# EAGLE design Iridium_9603_Beacon (EAGLE 8.6.0)

## Sheet 1 of 7
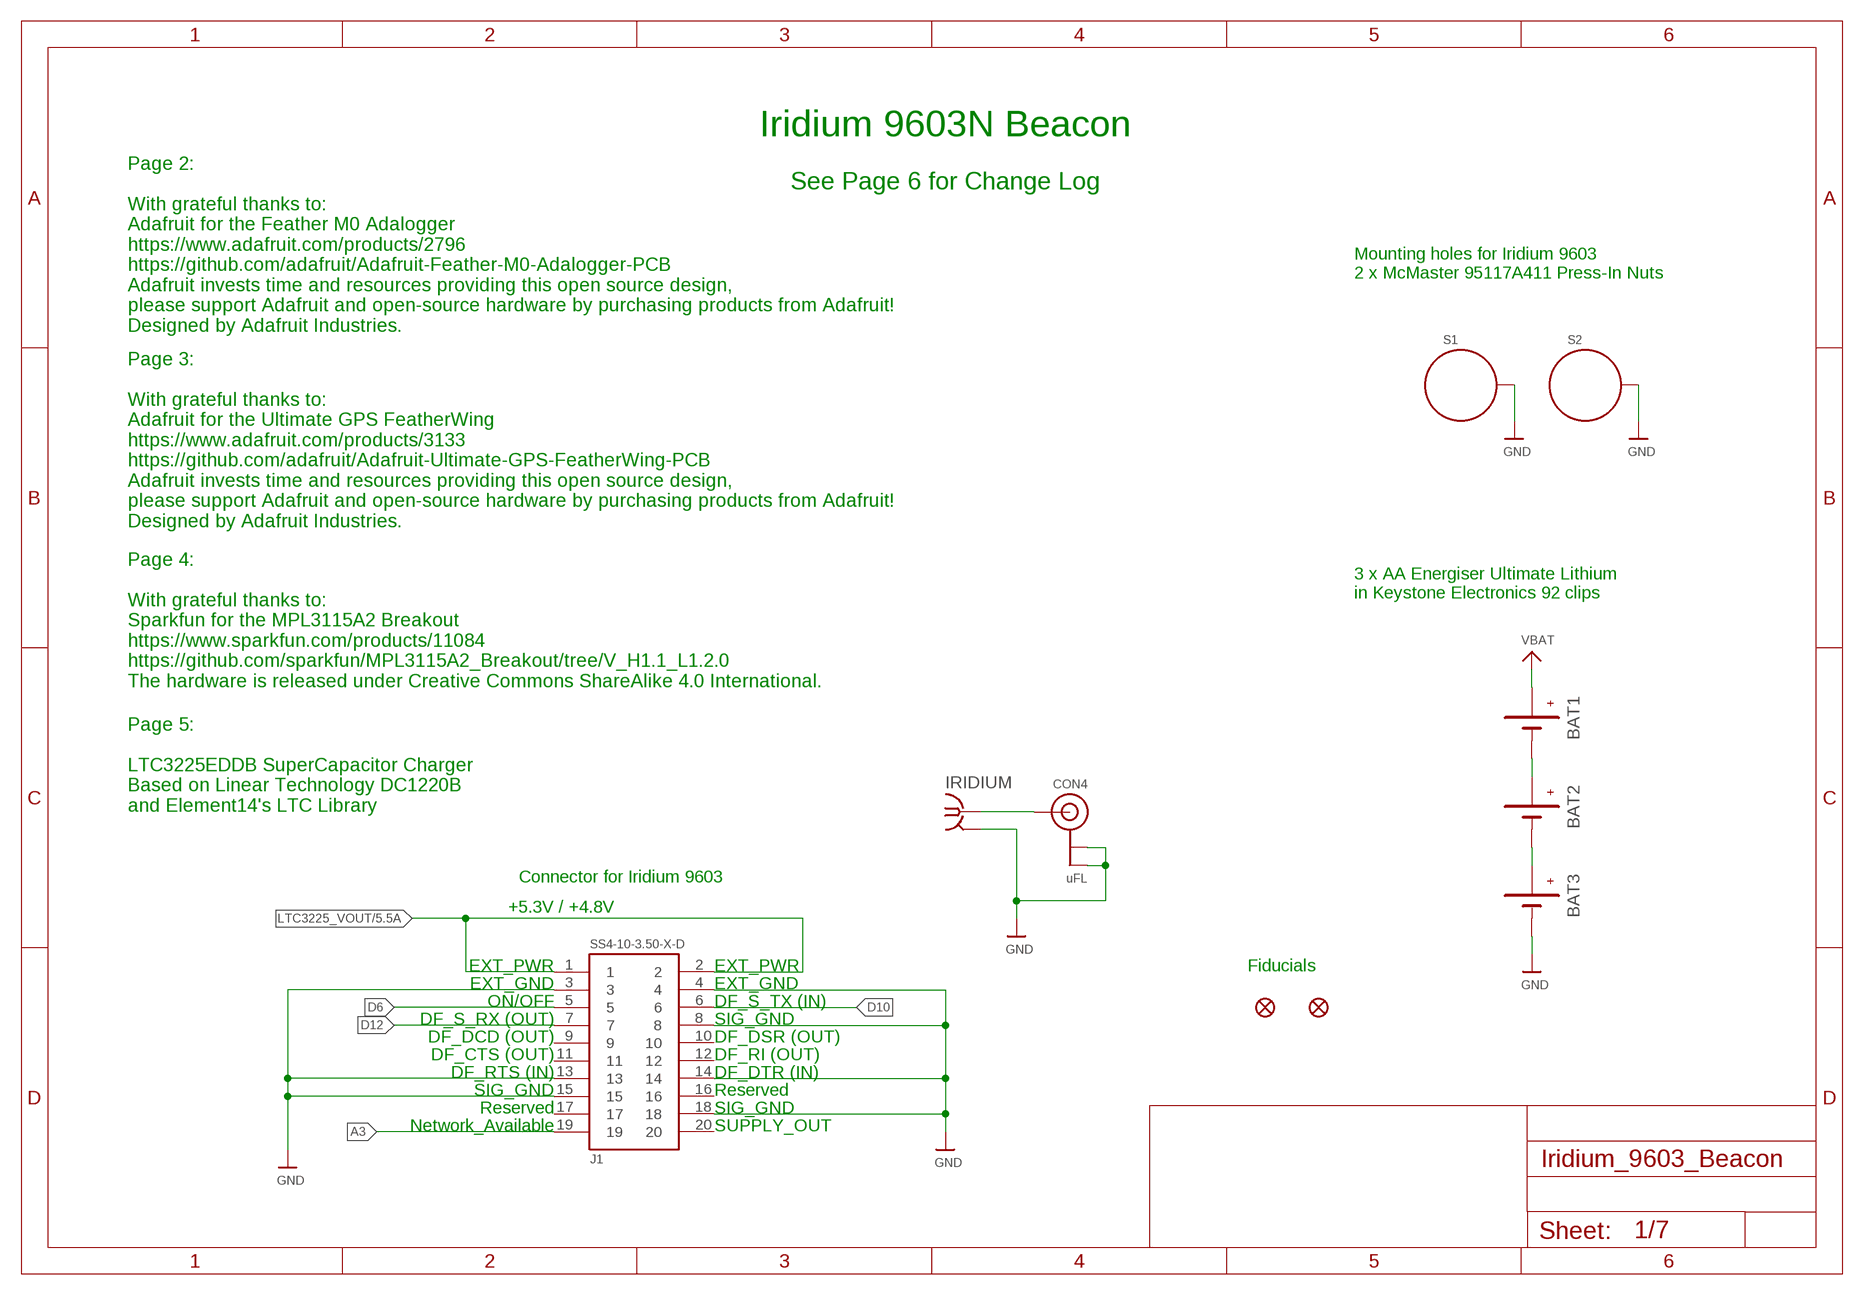
[diagram p0: schematic, sheet 1]

### Parts
BAT1  BATTERYKEYSTONE92  [BATTERY-AAA-KEYSTONE92]
BAT2  BATTERYKEYSTONE92  [BATTERY-AAA-KEYSTONE92]
BAT3  BATTERYKEYSTONE92  [BATTERY-AAA-KEYSTONE92]
CON4  uFL  ANTENNA_U.FL  [U.FL]
FD1  FIDUCIAL1X2  [FIDUCIAL-1X2]
FD2  FIDUCIAL1X2  [FIDUCIAL-1X2]
IRIDIUM  SMA-142-0711-821/826  [J502-ND-142-0711-821/826]
J1  SS4-10-3.50-X-D  [SS4-10-3.50-X-D]
S1  STANDOFF_ELECTRICALMCMASTER-95117A411  [STANDOFF-ELECTRICAL-MCMASTER-95117A411]
S2  STANDOFF_ELECTRICALMCMASTER-95117A411  [STANDOFF-ELECTRICAL-MCMASTER-95117A411]

### Nets
A3: J1.19 ; also sheet 2
D6: J1.5 ; also sheet 2
D10: J1.6 ; also sheet 2
D12: J1.7 ; also sheet 2
GND: BAT3.GND@1(-) BAT3.GND@2(-) CON4.1(GND) CON4.2(GND) IRIDIUM.G@1 IRIDIUM.G@2 IRIDIUM.G@3 IRIDIUM.G@4 J1.3 J1.4 J1.8 J1.13 J1.14 J1.15 J1.18 S1.P1 S2.P1 ; also sheet 2,3,4,5
LTC3225_VOUT: J1.1 J1.2 ; also sheet 5
N$2: CON4.3(SIGNAL) IRIDIUM.1
N$8: BAT1.GND@1(-) BAT1.GND@2(-) BAT2.PWR@1(+) BAT2.PWR@2(+)
N$15: BAT2.GND@1(-) BAT2.GND@2(-) BAT3.PWR@1(+) BAT3.PWR@2(+)
VBAT: BAT1.PWR@1(+) BAT1.PWR@2(+) ; also sheet 2
Unconnected: J1.9 J1.10 J1.11 J1.12 J1.16 J1.17 J1.20

### Notes on the sheet
- Iridium 9603N Beacon
- See Page 6 for Change Log
- Mounting holes for Iridium 9603
  2 x McMaster 95117A411 Press-In Nuts
- Page 2:
  
  With grateful thanks to:
  Adafruit for the Feather M0 Adalogger
  https://www.adafruit.com/products/2796
  https://github.com/adafruit/Adafruit-Feather-M0-Adalogger-PCB
  Adafruit invests time and resources providing this open source design,
  please support Adafruit and open-source hardware by purchasing products from Adafruit!
  Designed by Adafruit Industries.
- Page 3:
  
  With grateful thanks to:
  Adafruit for the Ultimate GPS FeatherWing
  https://www.adafruit.com/products/3133
  https://github.com/adafruit/Adafruit-Ultimate-GPS-FeatherWing-PCB
  Adafruit invests time and resources providing this open source design,
  please support Adafruit and open-source hardware by purchasing products from Adafruit!
  Designed by Adafruit Industries.
- 3 x AA Energiser Ultimate Lithium
  in Keystone Electronics 92 clips
- Page 4:
  
  With grateful thanks to:
  Sparkfun for the MPL3115A2 Breakout
  https://www.sparkfun.com/products/11084
  https://github.com/sparkfun/MPL3115A2_Breakout/tree/V_H1.1_L1.2.0
  The hardware is released under Creative Commons ShareAlike 4.0 International.
- Page 5:
  
  LTC3225EDDB SuperCapacitor Charger
  Based on Linear Technology DC1220B
  and Element14's LTC Library
- Connector for Iridium 9603
- +5.3V / +4.8V
- EXT_PWR | EXT_PWR | Fiducials
- EXT_GND | EXT_GND
- ON/OFF | DF_S_TX (IN)
- DF_S_RX (OUT) | SIG_GND
- DF_DCD (OUT) | DF_DSR (OUT)
- DF_CTS (OUT) | DF_RI (OUT)
- DF_RTS (IN) | DF_DTR (IN)
- SIG_GND | Reserved
- Reserved | SIG_GND
- Network_Available | SUPPLY_OUT

## Sheet 2 of 7
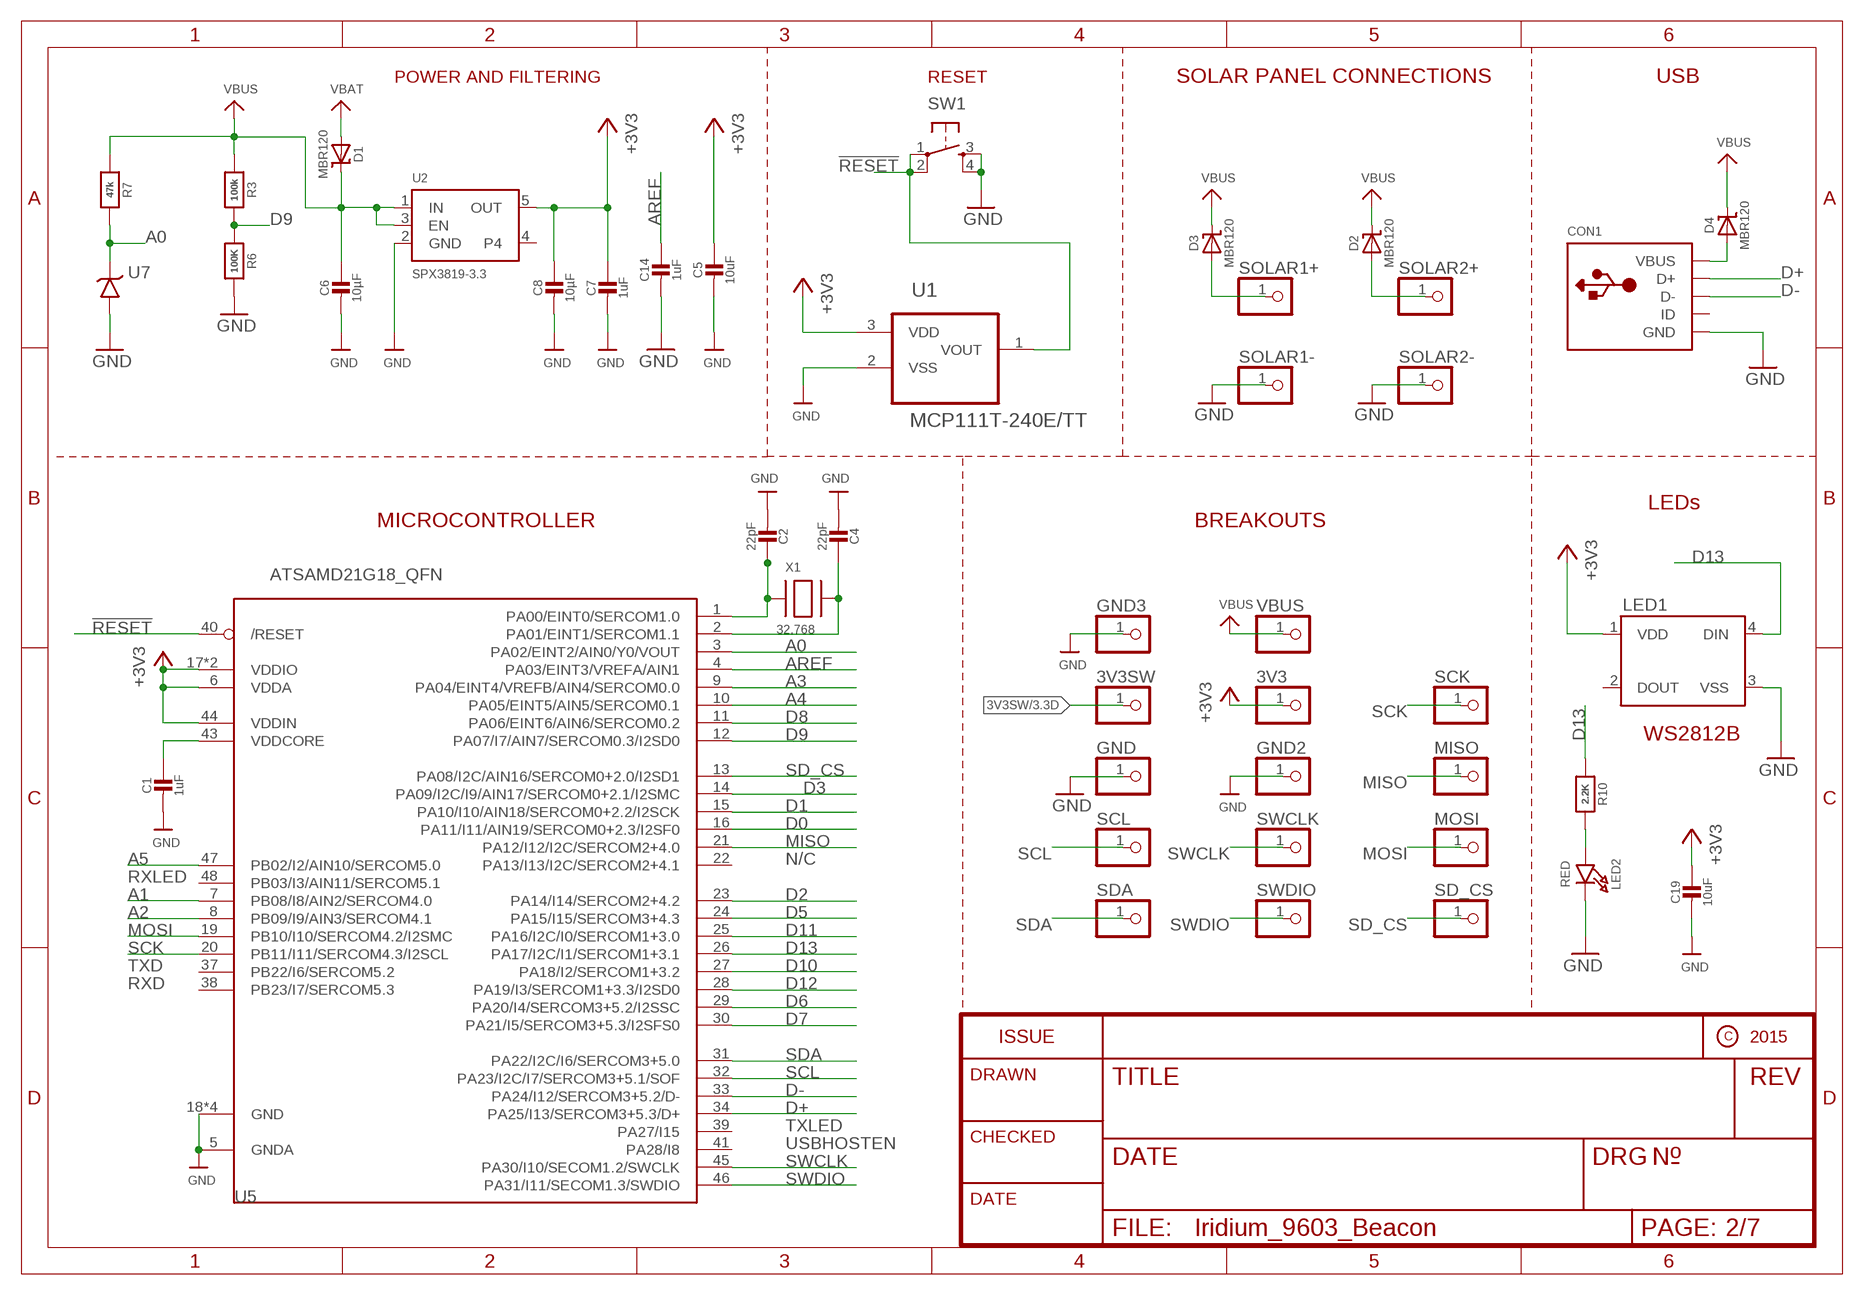
[diagram p1: schematic, sheet 2]

### Parts
3V3  PINHD-1X1  [1X01]
3V3SW  PINHD-1X1  [1X01]
C1  1uF  CAP_CERAMIC0603_NO  [0603-NO]
C2  22pF  CAP_CERAMIC0603_NO  [0603-NO]
C4  22pF  CAP_CERAMIC0603_NO  [0603-NO]
C5  10uF  CAP_CERAMIC0805-NOOUTLINE  [0805-NO]
C6  10µF  CAP_CERAMIC0805-NOOUTLINE  [0805-NO]
C7  1uF  CAP_CERAMIC0603_NO  [0603-NO]
C8  10µF  CAP_CERAMIC0805-NOOUTLINE  [0805-NO]
C14  1uF  CAP_CERAMIC0603_NO  [0603-NO]
C19  10uF  CAP_CERAMIC0805-NOOUTLINE  [0805-NO]
CON1  USBFCI_10103594  [FCI_10103594]
D1  MBR120  DIODE-SCHOTTKYSOD-123  [SOD-123]
D2  MBR120  DIODE-SCHOTTKYSOD-123  [SOD-123]
D3  MBR120  DIODE-SCHOTTKYSOD-123  [SOD-123]
D4  MBR120  DIODE-SCHOTTKYSOD-123  [SOD-123]
GND  PINHD-1X1  [1X01]
GND2  PINHD-1X1  [1X01]
GND3  PINHD-1X1  [1X01]
LED1  WS2812B  [WS2812B]
LED2  RED  LED0805_NOOUTLINE  [CHIPLED_0805_NOOUTLINE]
MISO  PINHD-1X1  [1X01]
MOSI  PINHD-1X1  [1X01]
R3  100k  RESISTOR_0603_NOOUT  [0603-NO]
R6  100K  RESISTOR_0603_NOOUT  [0603-NO]
R7  47k  RESISTOR_0603_NOOUT  [0603-NO]
R10  2.2K  RESISTOR_0603_NOOUT  [0603-NO]
SCK  PINHD-1X1  [1X01]
SCL  PINHD-1X1  [1X01]
SD_CS  PINHD-1X1  [1X01]
SDA  PINHD-1X1  [1X01]
SOLAR1+  PINHD-1X1  [1X01]
SOLAR1-  PINHD-1X1  [1X01]
SOLAR2+  PINHD-1X1  [1X01]
SOLAR2-  PINHD-1X1  [1X01]
SW1  SWITCH_SPST_4_PINRECT  [TACTILE_SWITCH_SMD_4.6X2.8MM]
SWCLK  PINHD-1X1  [1X01]
SWDIO  PINHD-1X1  [1X01]
U1  MCP111T-240E/TT  MCP111T-270E/TT  [SOT95P237X112-3N]
U2  SPX3819-3.3  VREG_SOT23-5  [SOT23-5]
U5  ATSAMD21G18_QFN  ATSAMD21J_QFN  [TQFN48_7MM]
U7  LT1634-1,25BMCMS8  [MSOP8]
VBUS  PINHD-1X1  [1X01]
X1  32.768  XTAL-3.2X1.5  [XTAL3215]

### Nets
3V3SW: 3V3SW.1 ; also sheet 3,4
!RESET: SW1.1 SW1.2 U1.1(VOUT) U5.40(/RESET)
+3V3: 3V3.1 C5.1 C7.1 C8.1 C19.1 LED1.1(VDD) U1.3(VDD) U2.5(OUT) U5.6(VDDA) U5.17(VDDIO) U5.36(VDDIO) U5.44(VDDIN) ; also sheet 3,4,5
A0: R7.2 U5.3(PA02/EINT2/AIN0/Y0/VOUT) U7.6(VOUT)
A1: U5.7(PB08/I8/AIN2/SERCOM4.0) ; also sheet 5
A2: U5.8(PB09/I9/AIN3/SERCOM4.1)
A3: U5.9(PA04/EINT4/VREFB/AIN4/SERCOM0.0) ; also sheet 1
A4: U5.10(PA05/EINT5/AIN5/SERCOM0.1)
A5: U5.47(PB02/I2/AIN10/SERCOM5.0)
AREF: C14.1 U5.4(PA03/EINT3/VREFA/AIN1)
D0: U5.16(PA11/I11/AIN19/SERCOM0+2.3/I2SF0) ; also sheet 3
D1: U5.15(PA10/I10/AIN18/SERCOM0+2.2/I2SCK) ; also sheet 3
D2: U5.23(PA14/I14/SERCOM2+4.2)
D3: U5.14(PA09/I2C/I9/AIN17/SERCOM0+2.1/I2SMC)
D5: U5.24(PA15/I15/SERCOM3+4.3) ; also sheet 5
D6: U5.29(PA20/I4/SERCOM3+5.2/I2SSC) ; also sheet 1
D7: U5.30(PA21/I5/SERCOM3+5.3/I2SFS0)
D8: U5.11(PA06/EINT6/AIN6/SERCOM0.2)
D9: R3.2 R6.1 U5.12(PA07/I7/AIN7/SERCOM0.3/I2SD0)
D10: U5.27(PA18/I2/SERCOM1+3.2) ; also sheet 1
D11: U5.25(PA16/I2C/I0/SERCOM1+3.0) ; also sheet 3
D12: U5.28(PA19/I3/SERCOM1+3.3/I2SD0) ; also sheet 1
D13: LED1.4(DIN) R10.1 U5.26(PA17/I2C/I1/SERCOM1+3.1)
D+: CON1.D+ U5.34(PA25/I13/SERCOM3+5.3/D+)
D-: CON1.D- U5.33(PA24/I12/SERCOM3+5.2/D-)
GND: C1.2 C2.2 C4.2 C5.2 C6.2 C7.2 C8.2 C14.2 C19.2 CON1.BASE@1(GND) CON1.BASE@2(GND) CON1.GND CON1.SPRT@1(GND) CON1.SPRT@2(GND) CON1.SPRT@3(GND) CON1.SPRT@4(GND) GND2.1 GND3.1 GND.1 LED1.3(VSS) LED2.C R6.2 SOLAR1-.1 SOLAR2-.1 SW1.3 SW1.4 U1.2(VSS) U2.2(GND) U5.5(GNDA) U5.18(GND) U5.35(GND) U5.42(GND) U5.THERMAL(GND) U7.4(GND) ; also sheet 1,3,4,5
MISO: MISO.1 U5.21(PA12/I12/I2C/SERCOM2+4.0)
MOSI: MOSI.1 U5.19(PB10/I10/SERCOM4.2/I2SMC)
N$3: LED2.A R10.2
N$4: D3.A SOLAR1+.1
N$5: C2.1 U5.1(PA00/EINT0/SERCOM1.0) X1.P$1
N$7: C4.1 U5.2(PA01/EINT1/SERCOM1.1) X1.P$2
N$14: D2.A SOLAR2+.1
N$16: CON1.VBUS D4.A
SCK: SCK.1 U5.20(PB11/I11/SERCOM4.3/I2SCL)
SCL: SCL.1 U5.32(PA23/I2C/I7/SERCOM3+5.1/SOF) ; also sheet 4
SD_CS: SD_CS.1 U5.13(PA08/I2C/AIN16/SERCOM0+2.0/I2SD1)
SDA: SDA.1 U5.31(PA22/I2C/I6/SERCOM3+5.0) ; also sheet 4
SWCLK: SWCLK.1 U5.45(PA30/I10/SECOM1.2/SWCLK)
SWDIO: SWDIO.1 U5.46(PA31/I11/SECOM1.3/SWDIO)
VBAT: D1.A ; also sheet 1
VBUS: C6.1 D1.C D2.C D3.C D4.C R3.1 R7.1 U2.1(IN) U2.3(EN) VBUS.1 ; also sheet 5
VDDCORE1: C1.1 U5.43(VDDCORE)
Unconnected: CON1.ID LED1.2(DOUT) U2.4 U5.22(PA13/I13/I2C/SERCOM2+4.1) U5.37(PB22/I6/SERCOM5.2) U5.38(PB23/I7/SERCOM5.3) U5.39(PA27/I15) U5.41(PA28/I8) U5.48(PB03/I3/AIN11/SERCOM5.1)

### Notes on the sheet
- POWER AND FILTERING | RESET | SOLAR PANEL CONNECTIONS | USB
- LEDs
- MICROCONTROLLER | BREAKOUTS
- WS2812B
- N/C
- RXLED
- TXD
- RXD
- TXLED
- USBHOSTEN

## Sheet 3 of 7
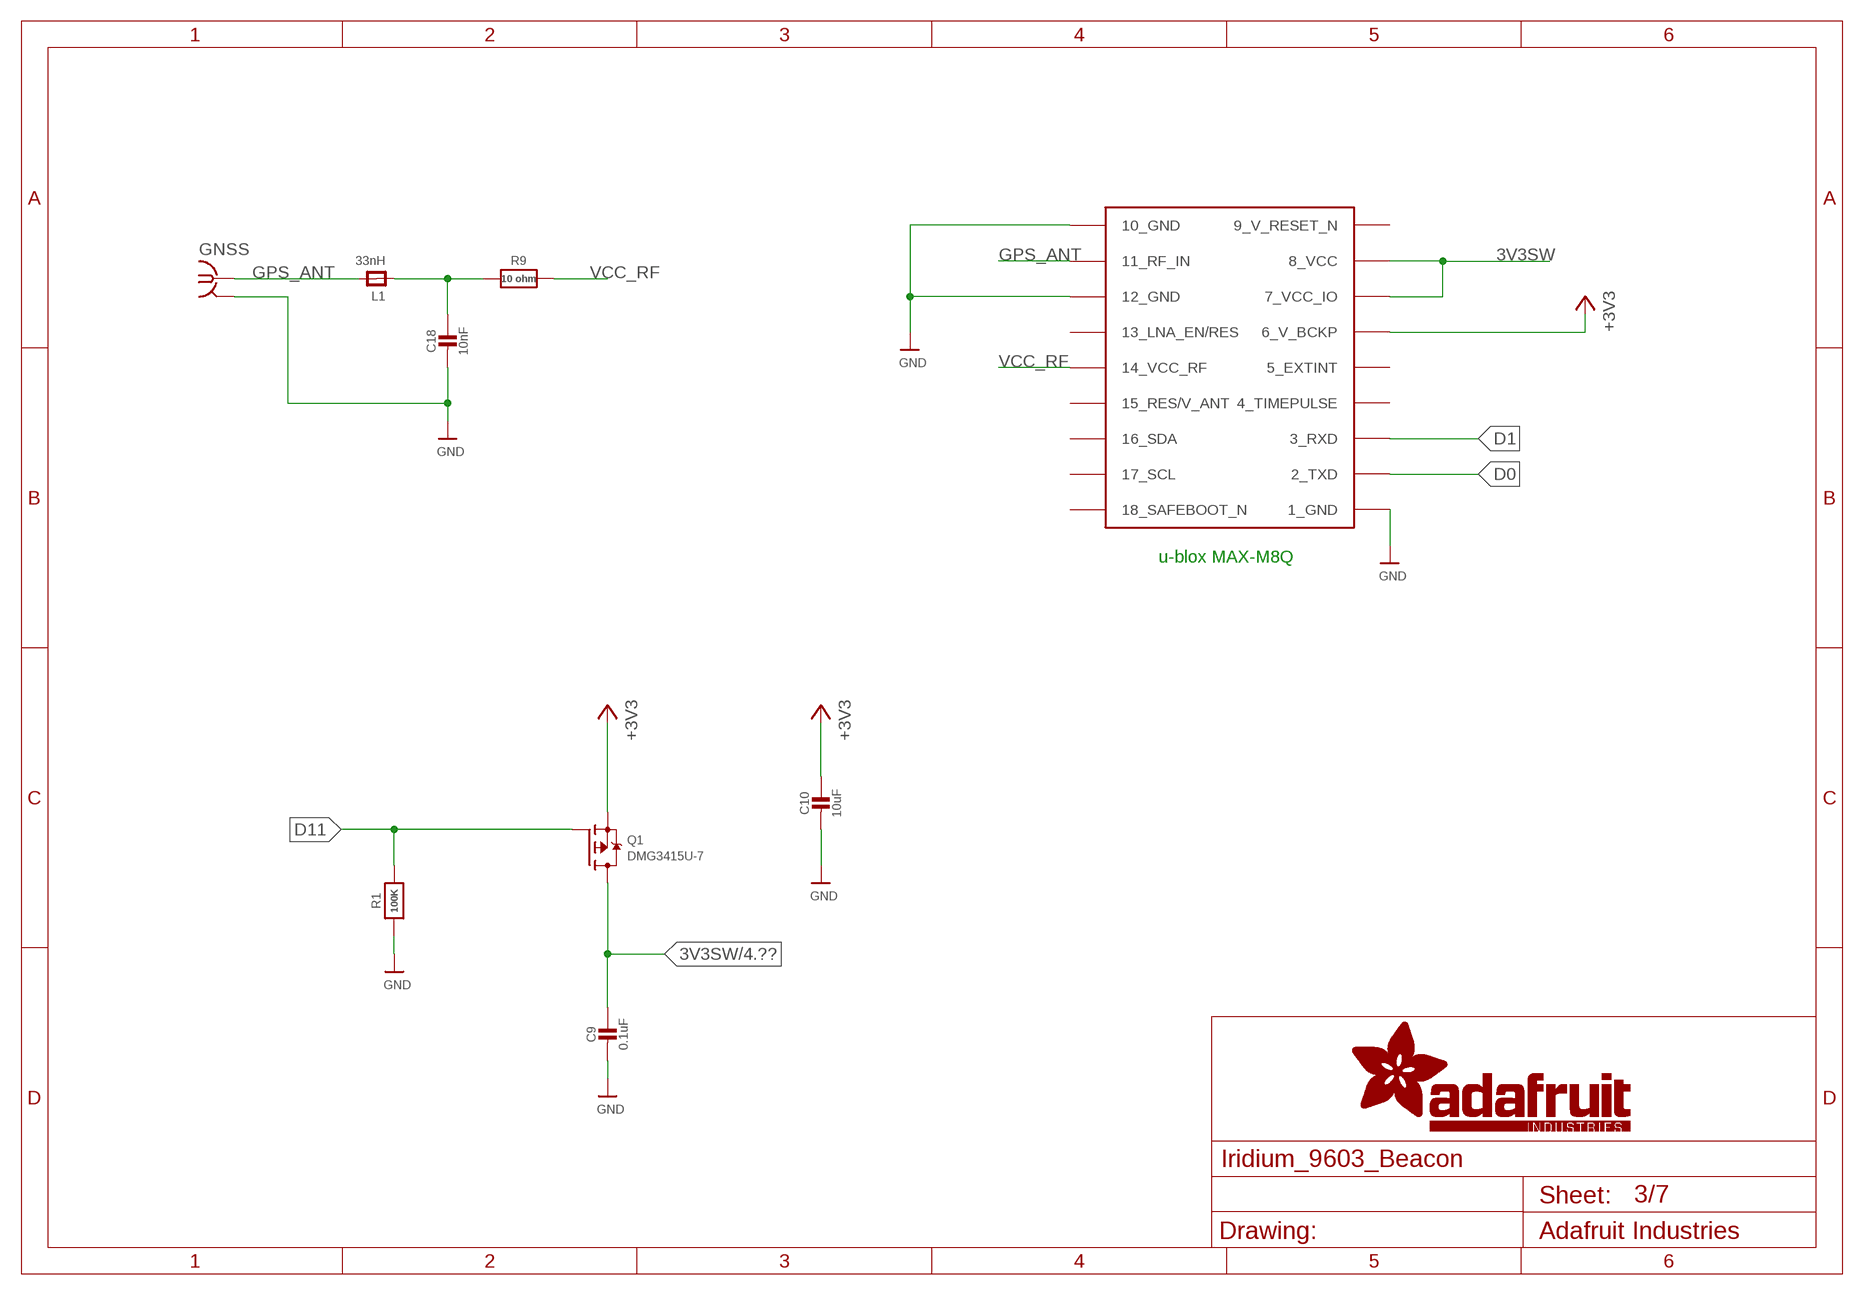
[diagram p2: schematic, sheet 3]

### Parts
C9  0.1uF  CAP_CERAMIC0805-NOOUTLINE  [0805-NO]
C10  10uF  CAP_CERAMIC0805-NOOUTLINE  [0805-NO]
C18  10nF  CAP_CERAMIC0805-NOOUTLINE  [0805-NO]
GNSS  SMA-142-0711-821/826  [J502-ND-142-0711-821/826]
L1  33nH  FERRITE-0805NO  [0805-NO]
Q1  DMG3415U-7  MOSFET-PWIDE  [SOT23-WIDE]
R1  100K  RESISTOR0805_NOOUTLINE  [0805-NO]
R9  10 ohm  RESISTOR0805_NOOUTLINE  [0805-NO]
U6  MAX-M8  [MAX-M8]

### Nets
3V3SW: C9.1 Q1.3(D) U6.7_VCC_IO U6.8_VCC ; also sheet 2,4
+3V3: C10.1 Q1.2(S) U6.6_V_BCKP ; also sheet 2,4,5
D0: U6.2_TXD ; also sheet 2
D1: U6.3_RXD ; also sheet 2
D11: Q1.1(G) R1.2 ; also sheet 2
GND: C9.2 C10.2 C18.2 GNSS.G@1 GNSS.G@2 GNSS.G@3 GNSS.G@4 R1.1 U6.1_GND U6.10_GND U6.12_GND ; also sheet 1,2,4,5
GPS_ANT: GNSS.1 L1.2 U6.11_RF_IN
N$1: C18.1 L1.1 R9.1
VCC_RF: R9.2 U6.14_VCC_RF
Unconnected: U6.4_TIMEPULSE U6.5_EXTINT U6.13_LNA_EN(13_LNA_EN/RES) U6.15_V_ANT/RESERVED(15_RES/V_ANT) U6.16_SDA U6.17_SCL U6.18_SAFEBOOT_N

### Notes on the sheet
- u-blox MAX-M8Q

## Sheet 4 of 7
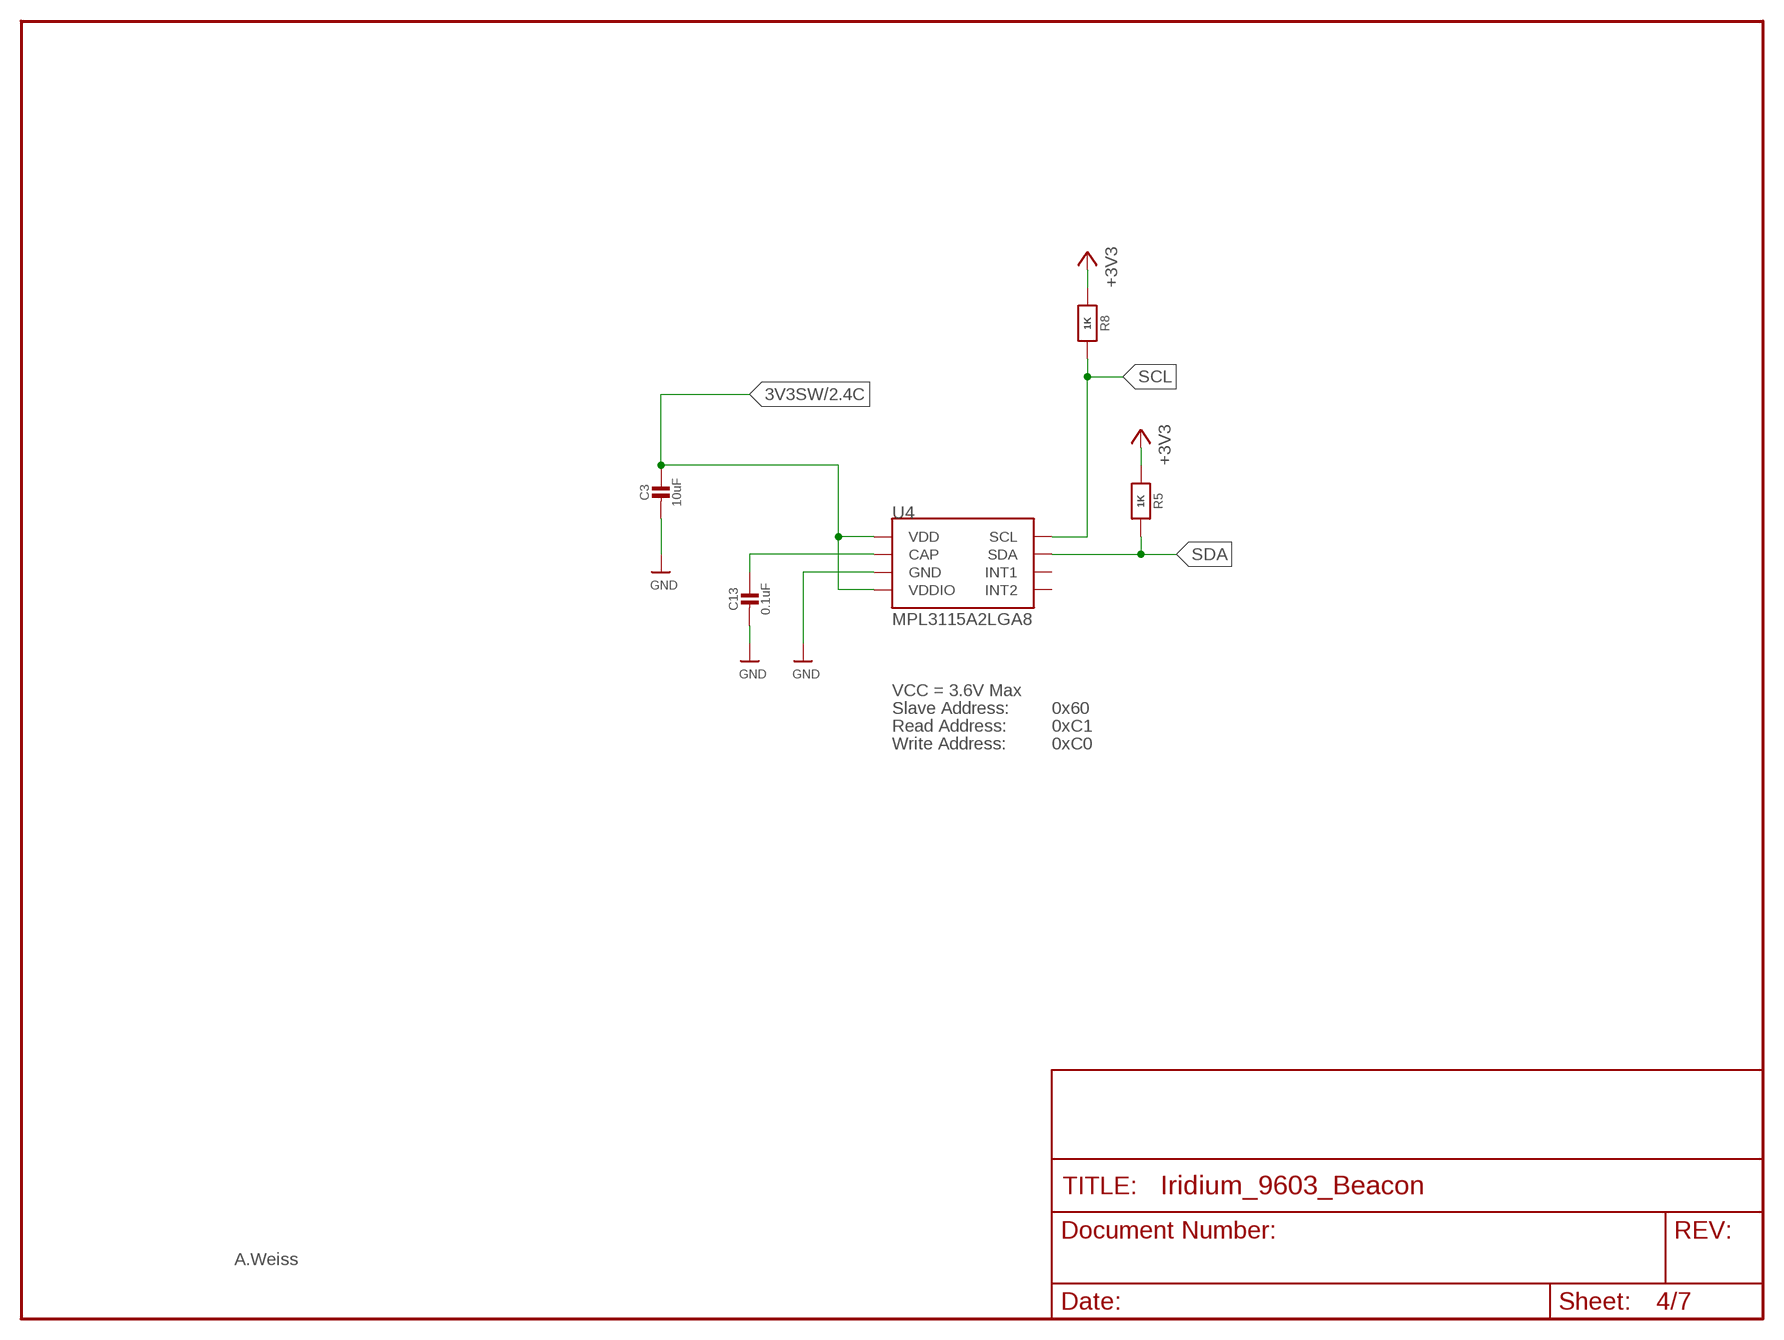
[diagram p3: schematic, sheet 4]

### Parts
C3  10uF  CAP_CERAMIC0805-NOOUTLINE  [0805-NO]
C13  0.1uF  CAP_CERAMIC0603_NO  [0603-NO]
R5  1K  RESISTOR_0603_NOOUT  [0603-NO]
R8  1K  RESISTOR_0603_NOOUT  [0603-NO]
U4  MPL3115A2LGA8  [LGA8]

### Nets
3V3SW: C3.1 U4.1(VDD) U4.4(VDDIO) ; also sheet 2,3
+3V3: R5.1 R8.1 ; also sheet 2,3,5
GND: C3.2 C13.2 U4.3(GND) ; also sheet 1,2,3,5
N$12: C13.1 U4.2(CAP)
SCL: R8.2 U4.8(SCL) ; also sheet 2
SDA: R5.2 U4.7(SDA) ; also sheet 2
Unconnected: U4.5(INT2) U4.6(INT1)

### Notes on the sheet
- VCC = 3.6V Max
- Slave Address: | 0x60
- Read Address: | 0xC1
- Write Address: | 0xC0
- A.Weiss

## Sheet 5 of 7
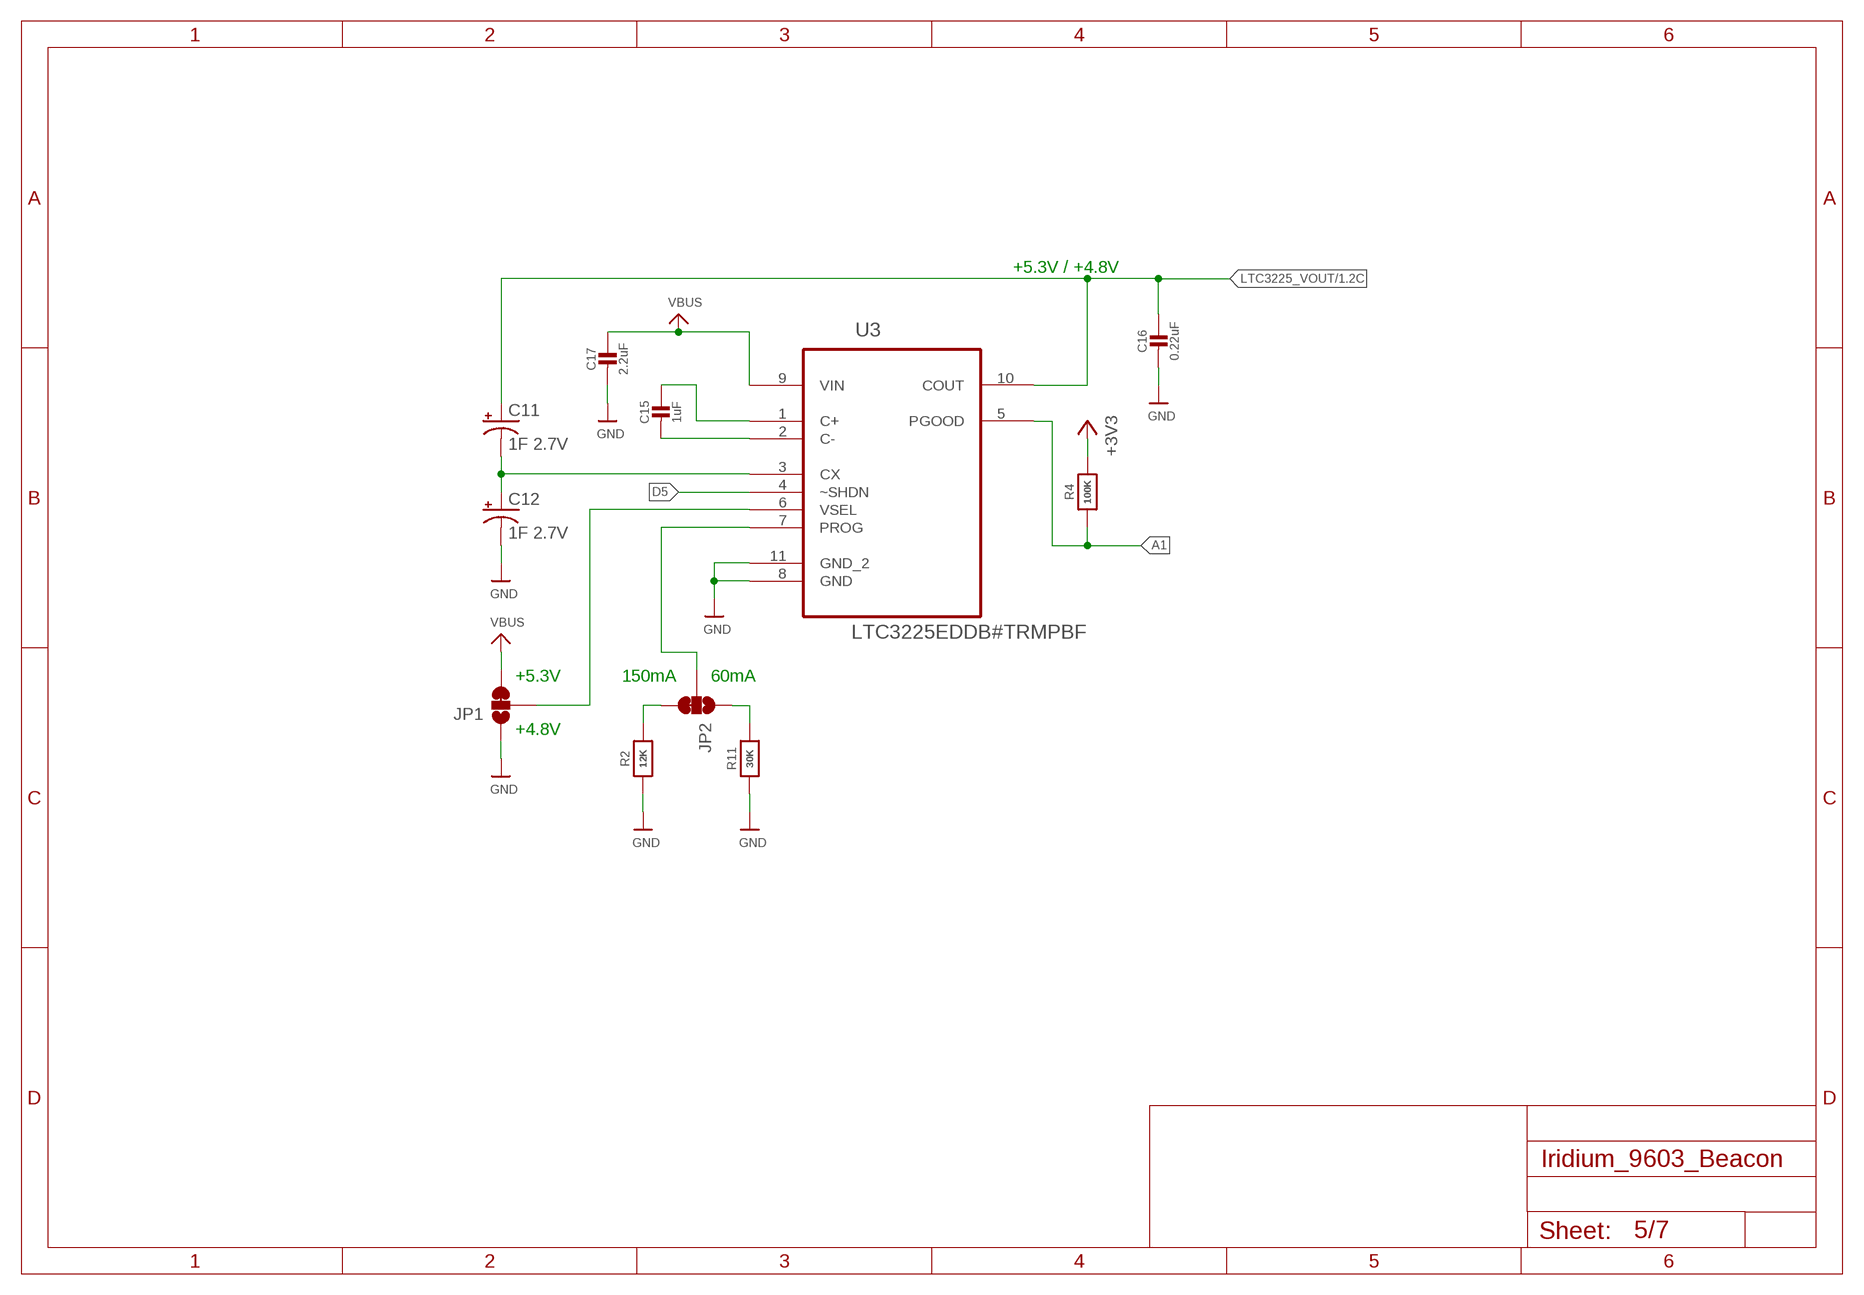
[diagram p4: schematic, sheet 5]

### Parts
C11  1F 2.7V  1F-2.7V(PTH)CPOL-RADIAL-1H-2.7V  [CPOL-RADIAL-1F-2.7V]
C12  1F 2.7V  1F-2.7V(PTH)CPOL-RADIAL-1H-2.7V  [CPOL-RADIAL-1F-2.7V]
C15  1uF  CAP_CERAMIC0603_NO  [0603-NO]
C16  0.22uF  CAP_CERAMIC0603_NO  [0603-NO]
C17  2.2uF  CAP_CERAMIC0805-NOOUTLINE  [0805-NO]
JP1  JUMPER-PAD-3-2OF3_NC_BY_TRACE_LARGE  [PAD-JUMPER-3-2OF3_NC_BY_TRACE_YES_SILK_LARGE]
JP2  JUMPER-PAD-3-2OF3_NC_BY_TRACE_LARGE  [PAD-JUMPER-3-2OF3_NC_BY_TRACE_YES_SILK_LARGE]
R2  12K  RESISTOR0805_NOOUTLINE  [0805-NO]
R4  100K  RESISTOR0805_NOOUTLINE  [0805-NO]
R11  30K  RESISTOR0805_NOOUTLINE  [0805-NO]
U3  LTC3225EDDB#TRMPBF  LTC3225EDDB-TRMPBFDFN300X200-10L  [DFN300X200-10L]

### Nets
+3V3: R4.2 ; also sheet 2,3,4
A1: R4.1 U3.5(PGOOD) ; also sheet 2
D5: U3.4(~SHDN) ; also sheet 2
GND: C12.- C16.2 C17.2 JP1.1 R2.1 R11.1 U3.8(GND) U3.11(GND_2) ; also sheet 1,2,3,4
LTC3225_VOUT: C11.+ C16.1 U3.10(COUT) ; also sheet 1
N$6: C11.- C12.+ U3.3(CX)
N$9: C15.2 U3.2(C-)
N$10: C15.1 U3.1(C+)
N$11: JP2.2 U3.7(PROG)
N$13: JP1.2 U3.6(VSEL)
N$17: JP2.3 R2.2
N$18: JP2.1 R11.2
VBUS: C17.1 JP1.3 U3.9(VIN) ; also sheet 2

### Notes on the sheet
- +5.3V / +4.8V
- +5.3V | 150mA | 60mA
- +4.8V

## Sheet 6 of 7
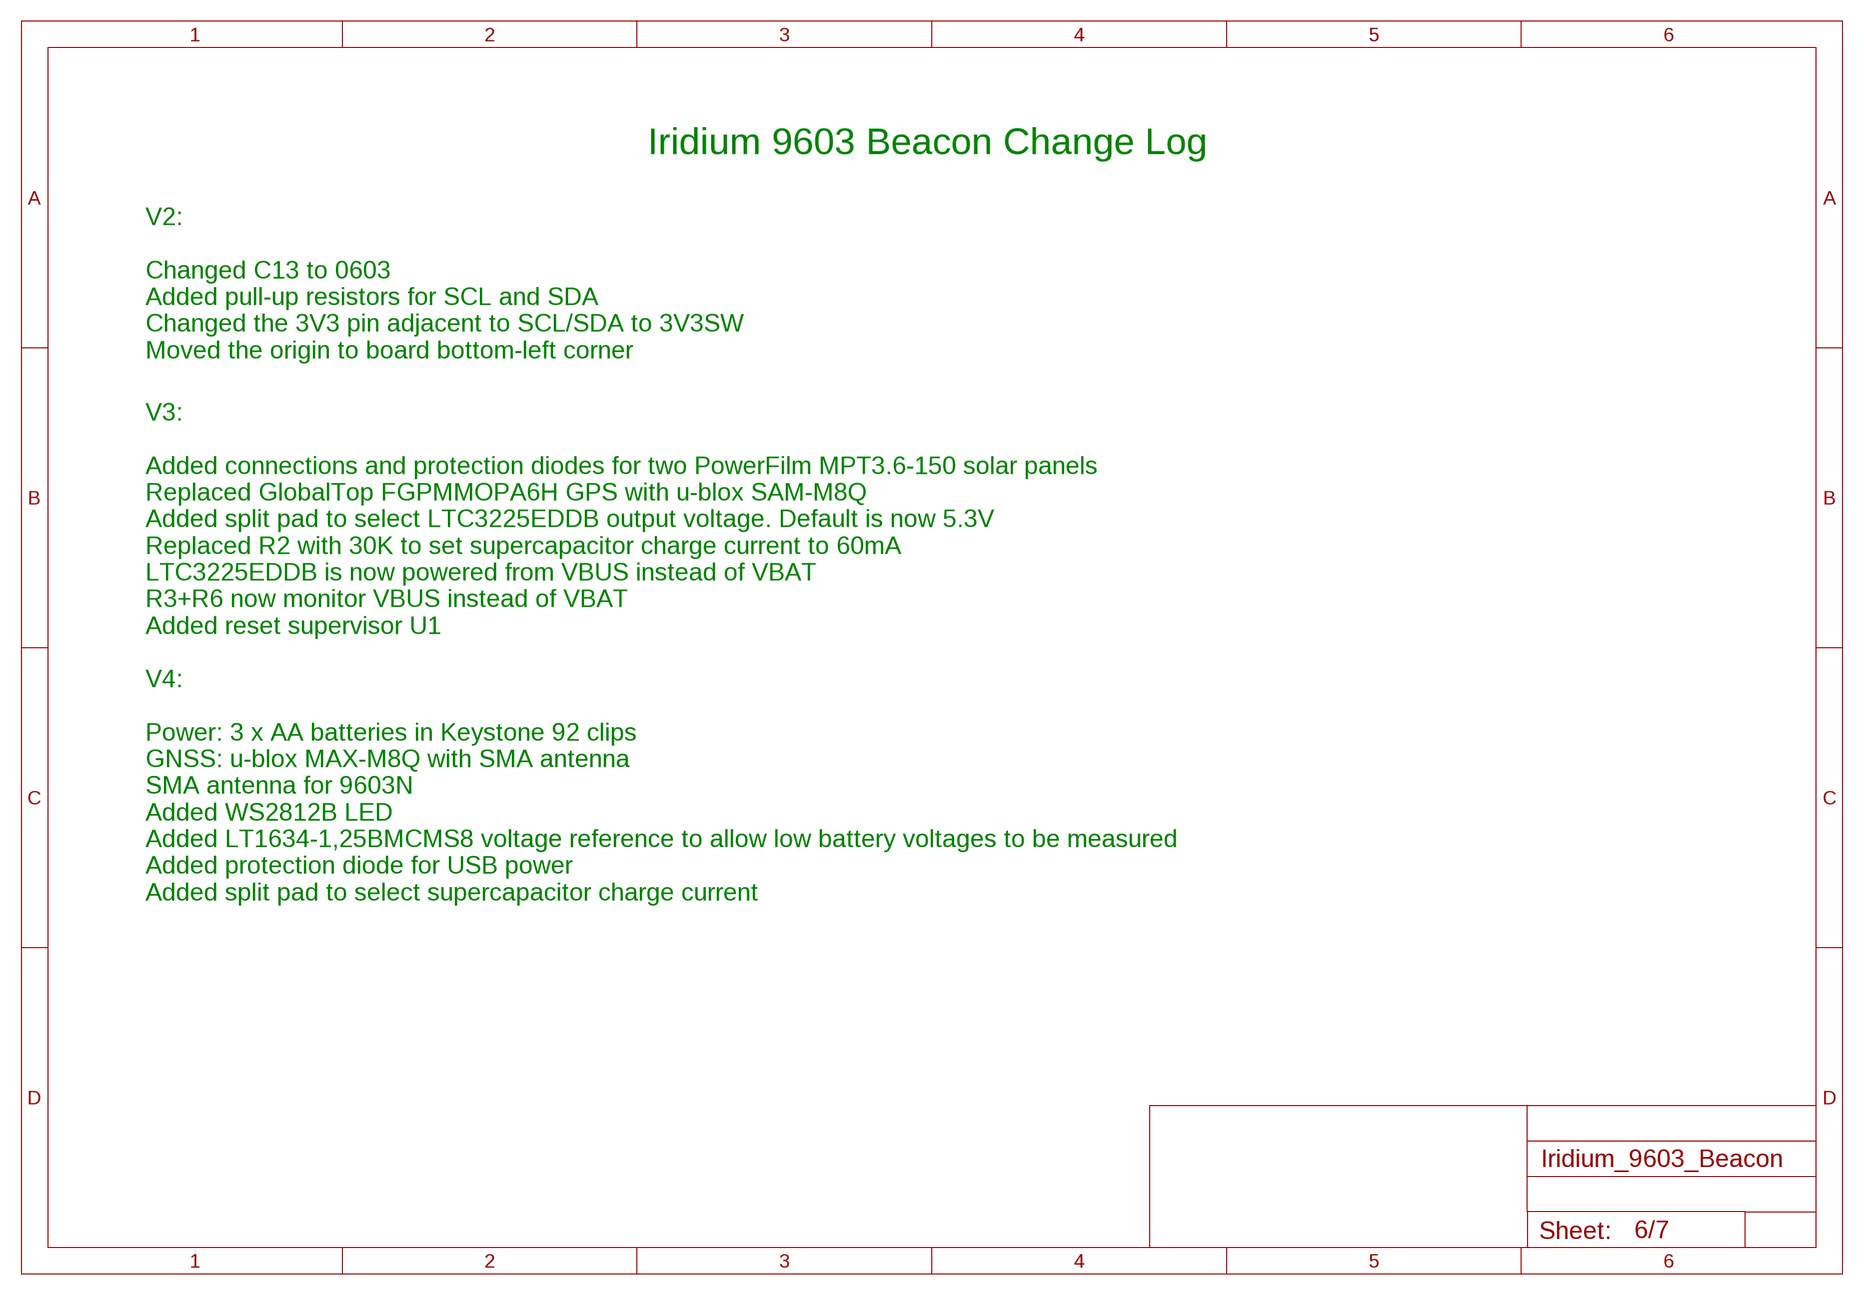
[diagram p5: schematic, sheet 6]

### Notes on the sheet
- Iridium 9603 Beacon Change Log
- V2:
  
  Changed C13 to 0603
  Added pull-up resistors for SCL and SDA
  Changed the 3V3 pin adjacent to SCL/SDA to 3V3SW
  Moved the origin to board bottom-left corner
- V3:
  
  Added connections and protection diodes for two PowerFilm MPT3.6-150 solar panels
  Replaced GlobalTop FGPMMOPA6H GPS with u-blox SAM-M8Q
  Added split pad to select LTC3225EDDB output voltage. Default is now 5.3V
  Replaced R2 with 30K to set supercapacitor charge current to 60mA
  LTC3225EDDB is now powered from VBUS instead of VBAT
  R3+R6 now monitor VBUS instead of VBAT
  Added reset supervisor U1
- V4:
  
  Power: 3 x AA batteries in Keystone 92 clips
  GNSS: u-blox MAX-M8Q with SMA antenna
  SMA antenna for 9603N
  Added WS2812B LED
  Added LT1634-1,25BMCMS8 voltage reference to allow low battery voltages to be measured
  Added protection diode for USB power
  Added split pad to select supercapacitor charge current

## Sheet 7 of 7
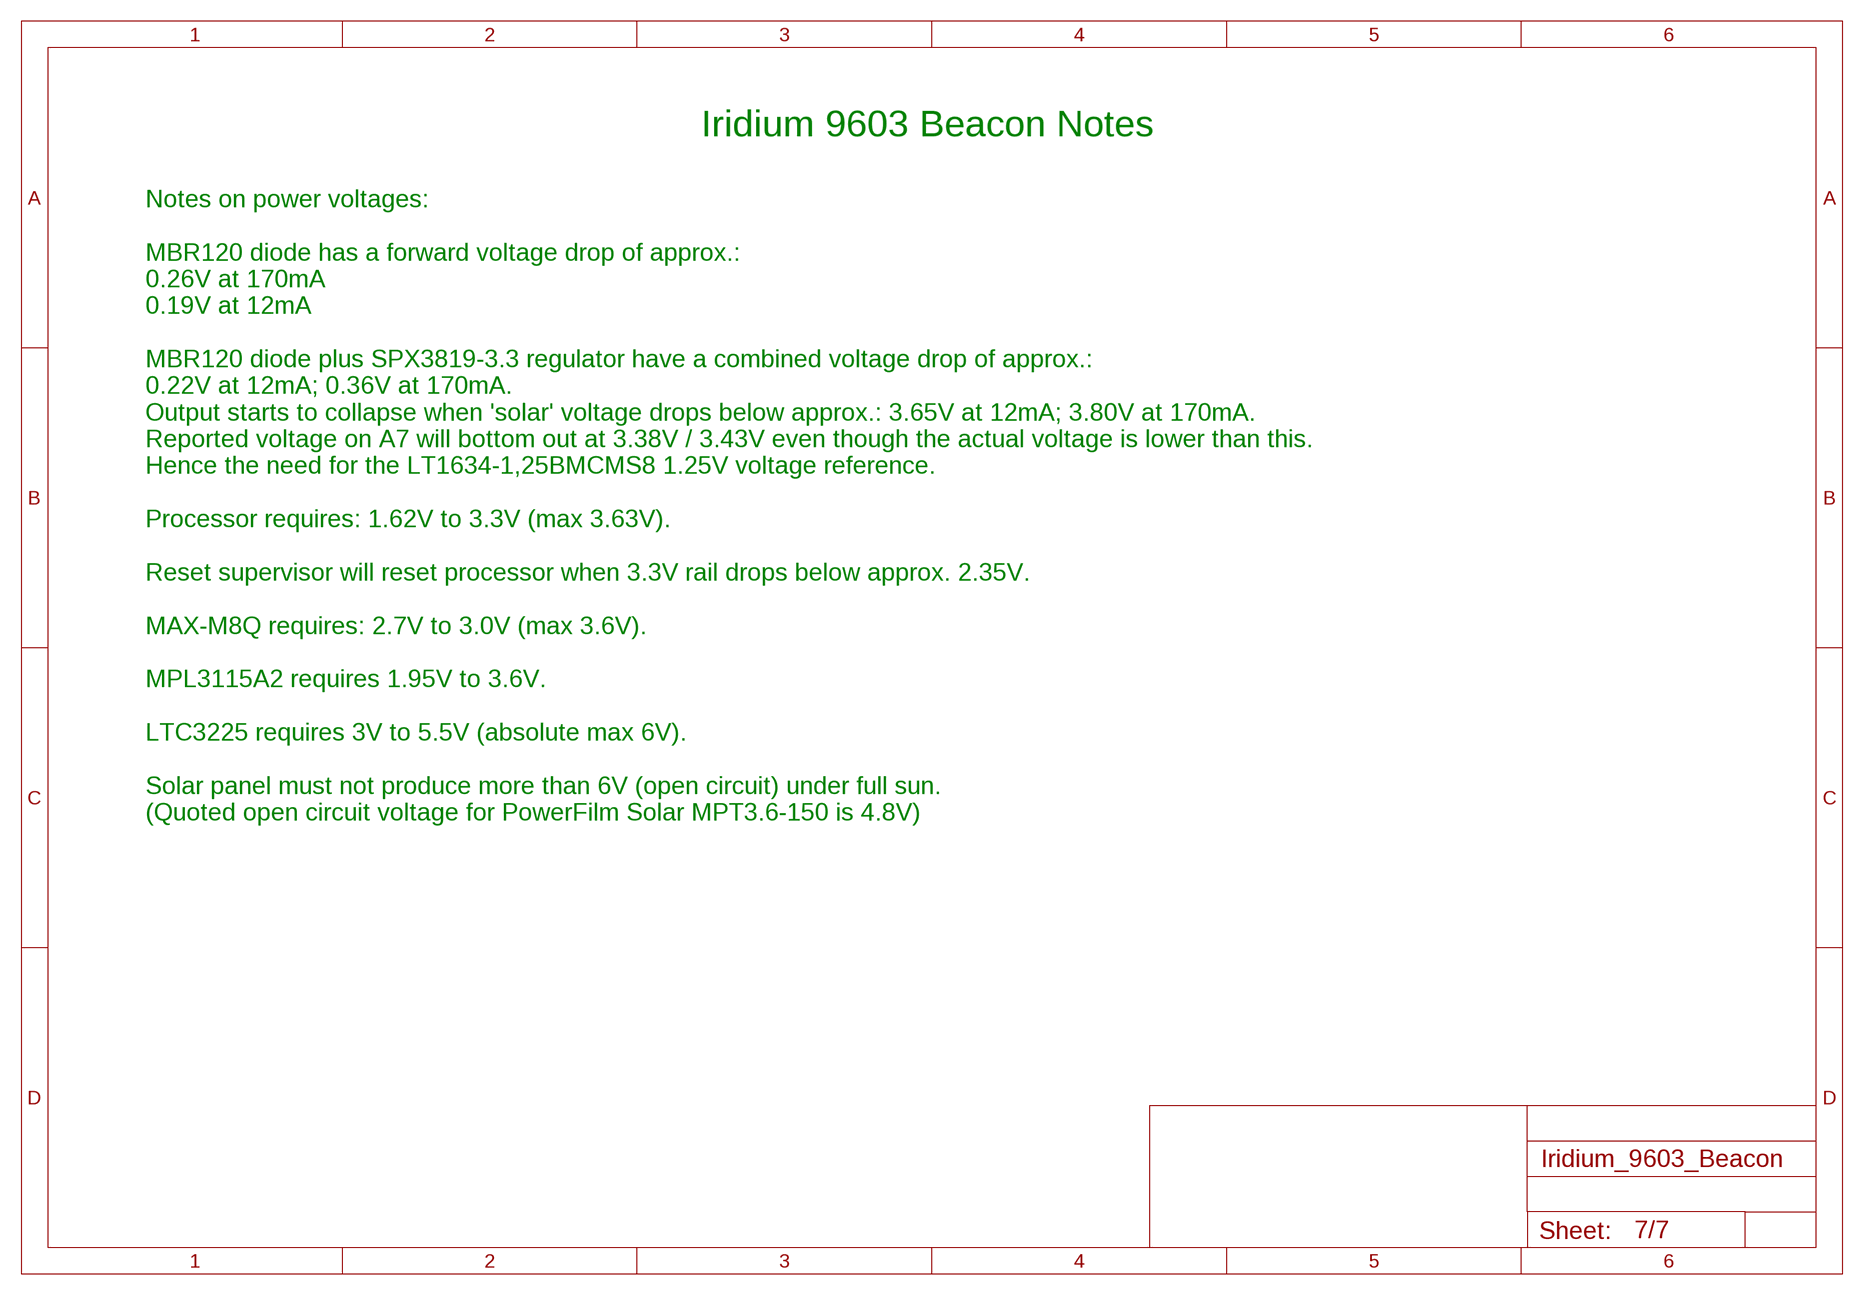
[diagram p6: schematic, sheet 7]

### Notes on the sheet
- Iridium 9603 Beacon Notes
- Notes on power voltages:
  
  MBR120 diode has a forward voltage drop of approx.:
  0.26V at 170mA
  0.19V at 12mA
  
  MBR120 diode plus SPX3819-3.3 regulator have a combined voltage drop of approx.:
  0.22V at 12mA; 0.36V at 170mA.
  Output starts to collapse when 'solar' voltage drops below approx.: 3.65V at 12mA; 3.80V at 170mA.
  Reported voltage on A7 will bottom out at 3.38V / 3.43V even though the actual voltage is lower than this.
  Hence the need for the LT1634-1,25BMCMS8 1.25V voltage reference.
  
  Processor requires: 1.62V to 3.3V (max 3.63V).
  
  Reset supervisor will reset processor when 3.3V rail drops below approx. 2.35V.
  
  MAX-M8Q requires: 2.7V to 3.0V (max 3.6V).
  
  MPL3115A2 requires 1.95V to 3.6V.
  
  LTC3225 requires 3V to 5.5V (absolute max 6V). 
  
  Solar panel must not produce more than 6V (open circuit) under full sun.
  (Quoted open circuit voltage for PowerFilm Solar MPT3.6-150 is 4.8V)

## Power pins joined to a net without a drawn wire
9_V_RESET_N: U6.9_RESET_N(9_V_RESET_N)

## Library data of the parts
3V3 3V3SW GND GND2 GND3 MISO MOSI SCK SCL SD_CS SDA SOLAR1+ SOLAR1- SOLAR2+ SOLAR2- SWCLK SWDIO VBUS = adafruit:PINHD-1X1: Pin header 1x1 for 0.1" spacing With round pins
BAT1-BAT3 = SparkFun-Electromechanical:BATTERY: Battery Holders Various common sizes : AA, AAA, 18650 (PRT-12895), 20mm coin cell and 12mm coin cell. 20MM_4LEGS, BATT-10373
C1-C10 C13-C19 = microbuilder:CAP_CERAMIC: Ceramic Capacitors For new designs, use the packages preceded by an '_' character since they are more reliable: The following footprints should be used on most boards: _0402 - Standard footprint for regular board layouts _0603 - Standard footprint for regular board layouts _0805 - Standard footprint for regular board layouts _1206 - Standard footprint for regular board layouts For extremely tight-pitch boards where space is at a premium, the following 'micro-pitch' footprints can be used (smaller pads, no silkscreen outline, etc.): _0402MP - Micro-pitch footprint for very dense/compact boards _0603MP - Micro-pitch footprint for very dense/compact boards _0805MP - Micro-pitch footprint for very dense/compact boards _1206MP - Micro-pitch footprint for very dense/compact boards
C11 C12 = SparkFun-Capacitors:1F-2.7V(PTH): CAP-08070
CON1 = microbuilder:USB: USB Connectors USBMINIB - Surface Mount Female Mini-B USB Connector 4UConnector: 06564
CON4 = microbuilder:ANTENNA_U.FL: U.FL Antenna Connector
D1-D4 = microbuilder:DIODE-SCHOTTKY
FD1 FD2 = SparkFun-Aesthetics:FIDUCIAL: Fiducial Alignment Points Various fiducial points for machine vision alignment.
GNSS IRIDIUM = con-coax:SMA-: SMA 50 Ohm End Launch Jack Receptacle - Round Contact Johnson Components Source: www.johnsoncomponents.com .. J502-ND.pdf; MF: JOHNSON COMPONENTS; MPN: 142-0711-821; OC_FARNELL: 1019328; OC_NEWARK: 16F3627
J1 = SS4-10-3.50-X-D:SS4-10-3.50-X-D: 0.4mm[.016] SOCKET STRIP ASSEMBLY.
JP1 JP2 = SparkFun-Passives:JUMPER-PAD-3-2OF3_NC_BY_TRACE
L1 = microbuilder:FERRITE: Ferrite Bead 0603 MMZ1608B121C - 120 Ohm @ 100MHz, 600mA, 0.15 Ohm DC Resistance - Digikey: 445-2164-1-ND BK1608HW121-T - 120 Ohm, 600mA Ferrite Chip - Digikey: 587-1876-2-ND 0805 HZ0805B272R-10 - 2.7K Ohm @ 100MHz, 200mA, 0.8 Ohm DC Resistance - Digikey: 240-2504-1-ND (see also Murata BLM21BD272SN1L) MMZ2012Y152B - 1.5K Ohm @ 100MHz, 500mA, 0.4 Ohm DC Resistance - Digikey: 445-1560-1-ND - Mainly for high frequency (80-400MHz) MMZ2012R102A - 1K Ohm @ 100MHz, 500mA, 0.3 Ohm DC Resistance - Digikey: 445-1555-2-ND - More general purpose (10-200MHz)
LED1 = SparkFun-LED:WS2812B: WS2812B - Intelligent control LED integrated light source Technical Specifications: Power Supply Voltage (VDD): 3.5 to 5.3 V Input Voltage (VI): -0.5 to VDD+0.5 V Operating Junction Temperature (Topt): -25°C to +80°C Storage Temperature Range (Tstg): -55°C to +150°C; PROD_ID: DIO-12503
LED2 = microbuilder:LED: LED 0603 - 0603 Surface Mount Package 2mA: Green LED - Low Power (3.9mcd, 2ma, 1.7Vf) - Digikey: 475-2709-2-ND Orange LED - Low Power (9.8mcd, 2ma, 1.8Vf) - Digikey: 475-1194-2-ND Red LED - Low Power (5mcd, 2ma, 1.8Vf) - Digikey: 475-1195-2-ND Yellow LED - Low Power (7mcd, 2ma, 1.8Vf) - Digikey: 475-1196-2-ND 5mA: Blue LED - Low Power (17mcd, 5ma, 2.9Vf) - Digikey: LNJ937W8CRACT-ND 0805 - 0805 Surface Mount Package 2mA: Red LED (8.8mcd, 2mA, 1.8Vf, Clear) - Low Power [Digikey: 475-2510-1-ND] Green LED (5mcd, 2mA, 1.8Vf, Clear) - Low Power [Digikey: 475-2730-1-ND] Yellow LED (11.3mcd, 2mA, 1.8Vf, Clear) - Low Power [Digikey: 475-2555-1-ND] 20mA: Red LED (104mcd, 20mA, Diffused) - LS R976 [Digikey: 475-1278-6-ND] Red LED (12mcd, 20mA, 2.0Vf, Clear) - APT2012EC [Digikey: 754-1128-1-ND] Green LED (15mcd, 20mA, 2.2Vf, Clear) - APT2012GC [Digikey: 754-1131-1-ND] Orange LED (160mcd, 20mA, 2.1Vf, Clear) - APT2012SECK [Digikey: 754-1130-1-ND] 1206 - 1206 Surface Mount Package Green LED (26mcd, 20mA, Diffused) - LG N971 [Digikey: 475-1407-6-ND] Red LED (15mcd, 20mA, Diffused) - LH N974 [Digikey: 475-1416-6-ND] Cree - Cree High-Power Surface Mount LEDs XPEBWT-L1-0000-00D50 - White 111lm 350mA 2.9Vf 6200K 110° XTEAWT-00-0000-00000LEE3 - White 114lm 350mA 2.85Vf 5000K 115° Everlight - Everlight 45-21 Series Surface Mount LEDs 45-21/QK2C-B2832AC2CB2/2T - Warm White 2000mcd 20mA 3.25Vf 3050K 120° 45-21/LK2C-B38452C4CB2/2T - Nuetral White 2000mcd 20mA 3.25Vf 4150K 120° 45-21/LK2C-B50634C6CB2/2T - Cold White 2200mcd 20mA 3.25Vf 5650K 120° PLCC2 Reverse Mount LS T77K-J1L2-1-0-2-R18-Z - Red 11.25mcd 2mA 1.8Vf 630nm 120° LO T77K-L1M2-24-Z - Orange 19.6mcd 2mA 1.8Vf 606nm 120° LY T77K-K2M1-26-Z - Yellow 15.7mcd 2mA 1.8Vf 587nm 120°
Q1 = microbuilder:MOSFET-P: P-Channel Mosfet LEGEND VDS: Voltage Drain-Source ID: Drain Current RDS(ON): Drain-Source On-State Resistance VGS(TH): Gate-Source Threshold Voltage CISS: Drain-Source Input Capacitance SOT-23 Name VDS ID RDS(ON) VGS(TH) CISS Order Number IRLML5103 30V 760mA 600 mOhm -- 75pF @ 25V Digikey: IRLML5103PBFCT-ND IRLML6401 12V 4.3A 50 mOhm 950mV @ 250µA 830pF @ 10V Digikey: IRLML6401PBFTR-ND NTR0202PL 20V 400mA 800 mOhm 2.3V @ 250uA 70pF @ 5V Digikey: NTR0202PLT1GOSTR-ND NTR4101PT1G 20V 1.8A 85 mOhm 1.2V @ 250uA 675pF @ 10V Digikey: NTR4101PT1GOSCT-ND DMP2004K 20V 600mA 900 mOhm 1V @ 250uA 175pF @ 16V Digikey: DMP2004KDICT-ND PMV65XP 20V 3.9A 76 mOhm 950mV @ 1mA 725pF @ 20V Digikey: 568-2358-2-ND TO-252 Name VDS ID RDS(ON) VGS(TH) CISS Order Number AOD417 30V 25A 34 mOhm 3V @ 250µA 920pF @ 15V Digikey: 785-1106-2-ND
R1-R11 = microbuilder:RESISTOR: Resistors For new designs, use the packages preceded by an '_' character since they are more reliable: The following footprints should be used on most boards: _0402 - Standard footprint for regular board layouts _0603 - Standard footprint for regular board layouts _0805 - Standard footprint for regular board layouts _1206 - Standard footprint for regular board layouts For extremely tight-pitch boards where space is at a premium, the following 'micro-pitch' footprints can be used (smaller pads, no silkscreen outline, etc.): _0402MP - Micro-pitch footprint for very dense/compact boards _0603MP - Micro-pitch footprint for very dense/compact boards _0805MP - Micro-pitch footprint for very dense/compact boards _1206MP - Micro-pitch footprint for very dense/compact boards
S1 S2 = SparkFun-Electromechanical:STANDOFF_ELECTRICAL: A standoff intended to be an electrically connected point.
SW1 = SparkFun-Electromechanical:SWITCH_SPST_4_PIN; PROD_ID: SWCH-13065
U1 = Microchip-MCP11:MCP11: Micropower Voltage Detector ,SOT23-3;; MPN: MCP111T-240E/TT; OC_FARNELL: 1851877; OC_NEWARK: 56J7328; PACKAGE: SOT23-3; SUPPLIER: MICROCHIP
U2 = microbuilder:VREG_SOT23-5: SOT23-5 Fixed Voltage Regulators Part Current Out V Out V In V Dropout θJA (°C/W) TJ (°C) Digikey Part No. ADP121 150mA 3.3V 3.4-5.5V 0.09V @ 150mA -- -- ADP121-AUJZ33R7CT-ND ADP121 150mA 3.0V 3.1-5.5V 0.09V @ 150mA -- -- ADP121-AUJZ30R7CT-ND ADP122 300mA 3.3V 3.4-5.5V 0.085V @ 300mA -- -- ADP122AUJZ-3.3-R7CT-ND ADP1712 300mA 3.3V 3.5-5.5V 0.17V @ 300mA -- -- ADP1712AUJZ-3.3-R7TR-ND AP7311 (Low Cost) 150mA 3.3V 3.5-6V 0.15V @ 150mA -- -- AP7311-33WG-7DICT-ND LD39015M18R 150mA 1.8V 1.9V-5.5V 0.08V @ 100mA -- -- 497-6977-1-ND LP2985A-33DBVR 150mA 3.3V 3.3-16V 0.28V @ 150mA 206 150 296-18479-1-ND MCP1824T-3302E/OT 300mA 3.3V 3.5V-6V 0.2V @ 300mA -- -- MCP1824T-3302E/OTCT-ND MIC5205-2.5YM5 TR 150mA 2.5V 2.7-16V 0.165V @ 150mA -- -- 576-1257-2-ND MIC5205-3.0YM5 TR 150mA 3.0V 3.2V-16V 0.165V @ 150mA -- -- 576-1258-2-ND MIC5205-3.3YM5 TR 150mA 3.3V 3.5V-16V 0.165V @ 150mA -- -- 576-1259-2-ND TPS780330220 150mA 3.3V+2.2V 3.6-5.5V 250mV Max -- -- 296-23332-1-ND TDA3663/N1,135 100mA 3.3V 3.5-45V 0.18V @ 50mA -- -- 568-5343-1-ND Max operating temp can be calculated using θJA, TJ (max junction temperature), and power in watts. Set the "Maximum Ambient Temperature" until it reaches TJ ("Max Junction Temperature"), which is the absolute limit for safe use of the regulator: Heat Sink Temperature Calculator <http://www.daycounter.com/Calculators/Heat-Sink-Temperature-Calculator.phtml> For example, With 12V source into a 3.3V LP2985 and a 30mA load, we are dissipating (12V-3.3V) * 0.03A = 0.261W. With a θJA of 206 °C/W, a TJ of 150°C, and 261mW we can safely use the chip without a heat sink up to 75°C (=147.1°C Junction Temperature).
U3 = LTC_By_element14_Batch_1:LTC3225EDDB-TRMPBF: 150mA Supercapacitor Charger
U4 = SparkFun-Sensors:MPL3115A2: Altimeter/Pressure Sensor, I2C, 1.95V-3.6V supply, 50 to 110kPa; PROD_ID: IC-10869
U5 = microbuilder:ATSAMD21J
U6 = ubloxLib:MAX-M8: u-blox MAX GNSS module
U7 = linear-technology:LT1634: Micropower Precision Shunt Voltage Reference Source: Darta sheet <http://cds.linear.com/docs/en/datasheet/1634fe.pdf>
X1 = adafruit2:XTAL: Low cost SMT crystals, no capacitors included http://www.ladyada.net/library/eagle

## Board
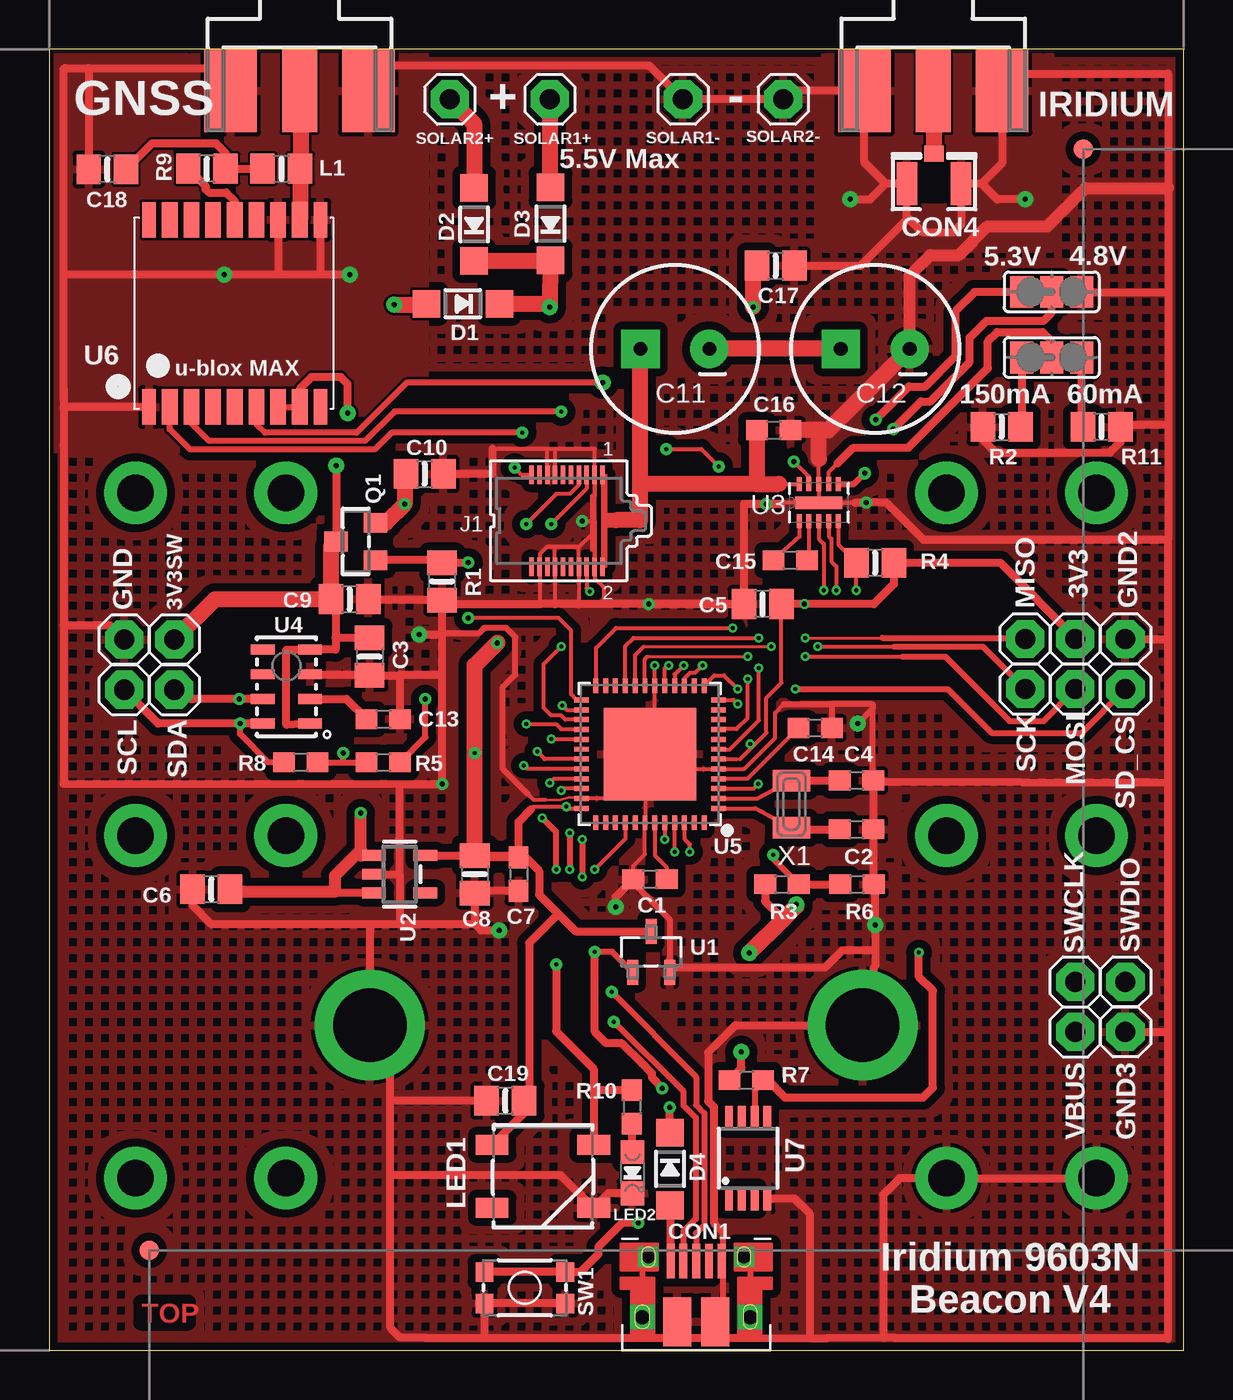
[diagram p7: board, top side]
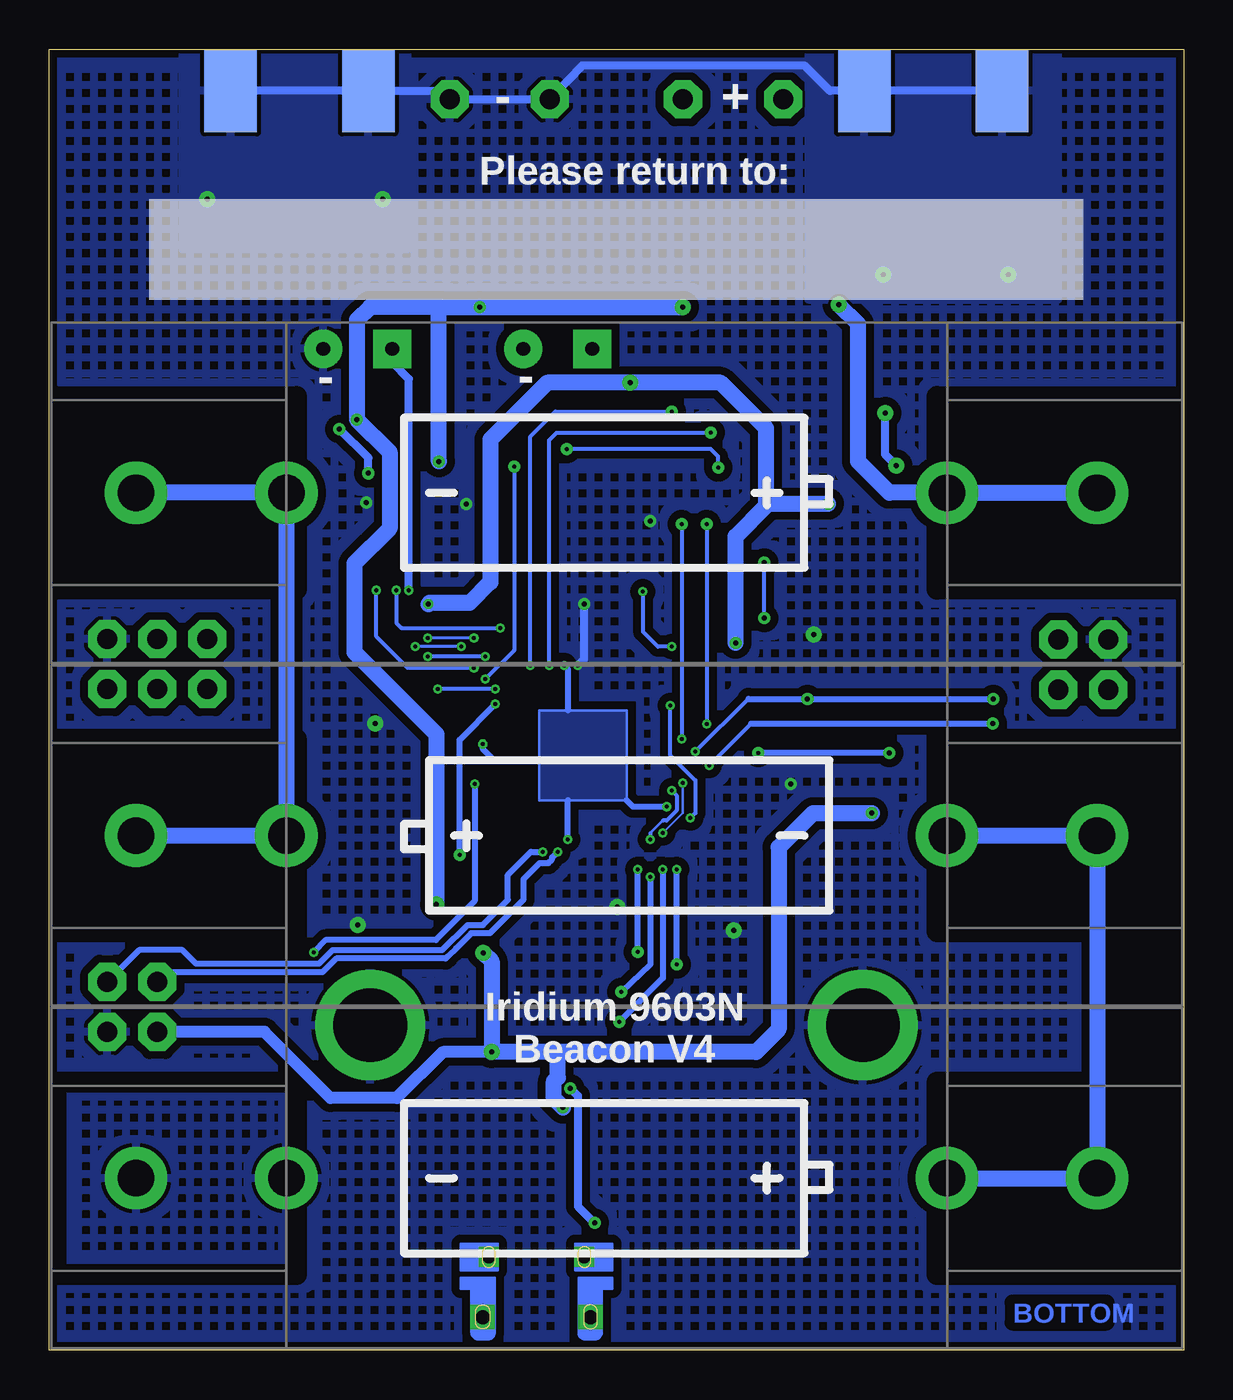
[diagram p8: board, bottom side, seen from below]

Size 57.56 x 66.04 mm. Coordinates in mm from the lower left corner, seen from the top.
Outline: 0,0 57.56,0 57.56,66.04 0,66.04 0,0
Copper layers (1*16): Top 0.018mm / dielectric 1.55mm / Bottom 0.018mm
Design rules "Multi-CB_2L_125um-Tracks_OL35um *": minimum track width 0.125mm, minimum drill 0.2mm, track to track 0.125mm, track to pad 0.125mm, pad to pad 0.125mm, via to via 0.125mm, smd to smd 0mil, copper to edge 0.2mm, drill to drill 0.2mm, minimum pad ring 0.125mm, minimum via ring 0.125mm, stop-mask expansion 2mil, vias tented up to drill 0.45mm, thermal gap 0.2mm

### Footprints (pad centres in the part's own frame; a part is rotated, then mirrored left to right if it is on the bottom)
1X01 = drill 1.016 pad 1.93 octagon: 1 0,0
BATTERY-AAA-KEYSTONE92 = drill 1.854 pad 3.175: GND@1 24.384,0; GND@2 16.764,0; PWR@1 -24.384,0; PWR@2 -16.764,0
0603-NO = smd 1.1 x 1: 1 -0.85,0; 2 0.85,0
0805-NO = smd 1.24 x 1.5: 1 -0.95,0; 2 0.95,0
CPOL-RADIAL-1F-2.7V = drill 0.7 pad 1.93 square: + 1.75,0 | drill 0.7 pad 1.93: - -1.75,0
FCI_10103594 = smd 1.425 x 2.5: BASE@1 -0.963,1.45; BASE@2 0.963,1.45 | smd 0.4 x 1.75: D+ 0,4.525; D- -0.65,4.525; GND 1.3,4.525; ID 0.65,4.525; VBUS -1.3,4.525 | drill 0.7 pad 1.25 square: SPRT@1 -2.736,1.679; SPRT@2 2.736,1.679 | drill 0.65 pad 1.016 square: SPRT@3 -2.426,4.747; SPRT@4 2.426,4.747
U.FL = smd 2.2 x 1.05: 1 0,1.375; 2 0,-1.375 | smd 0.8 x 1: 3 1.525,0
SOD-123 = smd 1.4 x 1.4: A 1.85,0; C -1.85,0
FIDUCIAL-1X2 = smd 1 x 1: 1 0,0
J502-ND-142-0711-821/826 = smd 4.191 x 1.778: 1 2.115,0 | smd 4.191 x 2.667: G@1 2.115,3.495; G@2 2.115,-3.495 | smd 4.191 x 2.667 bottom: G@3 2.115,3.495; G@4 2.115,-3.495
SS4-10-3.50-X-D = smd 0.23 x 0.93: 1 1.8,2.335; 2 1.8,-2.335; 3 1.4,2.335; 4 1.4,-2.335; 5 1,2.335; 6 1,-2.335; 7 0.6,2.335; 8 0.6,-2.335; 9 0.2,2.335; 10 0.2,-2.335; 11 -0.2,2.335; 12 -0.2,-2.335; 13 -0.6,2.335; 14 -0.6,-2.335; 15 -1,2.335; 16 -1,-2.335; 17 -1.4,2.335; 18 -1.4,-2.335; 19 -1.8,2.335; 20 -1.8,-2.335
PAD-JUMPER-3-2OF3_NC_BY_TRACE_YES_SILK_LARGE = smd 1.168 x 1.6: 1 -1.524,0; 2 0,0; 3 1.524,0
WS2812B = smd 1.651 x 1: 1 -2.577,1.6; 2 -2.577,-1.6; 3 2.577,-1.6; 4 2.577,1.6
CHIPLED_0805_NOOUTLINE = smd 1.2 x 1.2: A 0,-1.05; C 0,1.05
SOT23-WIDE = smd 1 x 1.2: 1 -0.95,-1; 2 0.95,-1; 3 0,1
STANDOFF-ELECTRICAL-MCMASTER-95117A411 = drill 3.734 pad 5.588: P1 0,0
TACTILE_SWITCH_SMD_4.6X2.8MM = smd 0.9 x 1: 1 -2.05,-0.8; 2 2.05,-0.8; 3 2.05,0.8; 4 -2.05,0.8
SOT95P237X112-3N = smd 0.559 x 1.27: 1 -0.94,-1.041; 2 0.94,-1.041; 3 0,1.041
SOT23-5 = smd 0.55 x 1.2: 1 -0.95,-1.3; 2 0,-1.3; 3 0.95,-1.3; 4 0.95,1.3; 5 -0.95,1.3
DFN300X200-10L = smd 0.711 x 0.254: 1 -0.94,0.991; 2 -0.94,0.508; 3 -0.94,0; 4 -0.94,-0.508; 5 -0.94,-0.991; 6 0.94,-0.991; 7 0.94,-0.508; 8 0.94,0; 9 0.94,0.508; 10 0.94,0.991 | smd 0.635 x 2.388: 11 0,0
LGA8 = smd 1.2 x 0.5: 1 -1.2,1.875; 2 -1.2,0.625; 3 -1.2,-0.625; 4 -1.2,-1.875; 5 1.2,-1.875; 6 1.2,-0.625; 7 1.2,0.625; 8 1.2,1.875
TQFN48_7MM = smd 0.25 x 0.75: 1 -2.75,-3.475; 2 -2.25,-3.475; 3 -1.75,-3.475; 4 -1.25,-3.475; 5 -0.75,-3.475; 6 -0.25,-3.475; 7 0.25,-3.475; 8 0.75,-3.475; 9 1.25,-3.475; 10 1.75,-3.475; 11 2.25,-3.475; 12 2.75,-3.475; 25 2.75,3.475; 26 2.25,3.475; 27 1.75,3.475; 28 1.25,3.475; 29 0.75,3.475; 30 0.25,3.475; 31 -0.25,3.475; 32 -0.75,3.475; 33 -1.25,3.475; 34 -1.75,3.475; 35 -2.25,3.475; 36 -2.75,3.475 | smd 0.75 x 0.25: 13 3.475,-2.75; 14 3.475,-2.25; 15 3.475,-1.75; 16 3.475,-1.25; 17 3.475,-0.75; 18 3.475,-0.25; 19 3.475,0.25; 20 3.475,0.75; 21 3.475,1.25; 22 3.475,1.75; 23 3.475,2.25; 24 3.475,2.75; 37 -3.475,2.75; 38 -3.475,2.25; 39 -3.475,1.75; 40 -3.475,1.25; 41 -3.475,0.75; 42 -3.475,0.25; 43 -3.475,-0.25; 44 -3.475,-0.75; 45 -3.475,-1.25; 46 -3.475,-1.75; 47 -3.475,-2.25; 48 -3.475,-2.75 | smd 4.7 x 4.7: THERMAL 0,0
MAX-M8 = smd 1.8 x 0.7: 1_GND 4.95,-4.4; 9_RESET_N 4.95,4.3; 10_GND -4.55,4.3; 18_SAFEBOOT_N -4.55,-4.4 | smd 1.8 x 0.8: 2_TXD 4.95,-3.35; 3_RXD 4.95,-2.25; 4_TIMEPULSE 4.95,-1.15; 5_EXTINT 4.95,-0.05; 6_V_BCKP 4.95,1.05; 7_VCC_IO 4.95,2.15; 8_VCC 4.95,3.25; 11_RF_IN -4.55,3.25; 12_GND -4.55,2.15; 13_LNA_EN -4.55,1.05; 14_VCC_RF -4.55,-0.05; 15_V_ANT/RESERVED -4.55,-1.15; 16_SDA -4.55,-2.25; 17_SCL -4.55,-3.35
MSOP8 = smd 0.4 x 1.2: 1 -0.975,-2.05; 2 -0.325,-2.05; 3 0.325,-2.05; 4 0.975,-2.05; 5 0.975,2.05; 6 0.325,2.05; 7 -0.325,2.05; 8 -0.975,2.05
XTAL3215 = smd 1.1 x 1.9: P$1 1.2,0; P$2 -1.2,0

### Placement (x,y rotation side)
3V3  52.07,36.1 270 top
3V3SW  6.35,36.07 90 top
BAT1  28.77,43.53 180 bottom
BAT2  28.77,26.13 0 bottom
BAT3  28.77,8.73 180 bottom
C1  30.48,23.91 180 top
C2  40.96,26.45 0 top
C3  16.26,35.21 270 top
C4  40.96,28.92 0 top
C5  36.2,37.88 180 top
C6  8.22,23.4 180 top
C7  23.81,24.16 270 top
C8  21.59,24.16 270 top
C9  15.24,38.13 0 top
C10  19.05,44.48 0 top
C11  31.75,50.83 180 top
C12  41.91,50.83 180 top
C13  16.95,32.04 0 top
C14  38.86,31.59 0 top
C15  37.59,40.1 0 top
C16  36.77,46.7 0 top
C17  36.86,55.05 0 top
C18  2.95,59.94 180 top
C19  23.15,12.67 180 top
CON1  32.83,0 0 top
CON4  44.89,59.21 90 top
D1  20.99,53.12 180 top
D2  21.56,57.15 90 top
D3  25.43,57.18 90 top
D4  31.5,9.21 270 top
FD1  5.08,5.08 0 top
FD2  52.48,60.96 0 top
GND  3.81,36.07 90 top
GND2  54.61,36.1 270 top
GND3  54.61,16.16 270 top
GNSS  12.7,66.04 270 top
IRIDIUM  44.86,66.04 270 top
J1  26.27,42.1 0 top
JP1  50.86,53.72 180 top
JP2  50.86,50.39 180 top
L1  11.78,59.98 0 top
LED1  25.05,8.83 0 top
LED2  29.59,9.02 180 top
MISO  49.53,36.1 270 top
MOSI  52.07,33.56 90 top
Q1  15.56,41.05 90 top
R1  19.94,39.02 90 top
R2  48.32,46.86 0 top
R3  37.18,23.65 0 top
R4  41.91,39.97 0 top
R5  16.95,29.84 0 top
R6  40.99,23.65 0 top
R7  35.37,13.72 0 top
R8  12.76,29.84 180 top
R9  8,59.98 180 top
R10  29.56,12.35 270 top
R11  53.4,46.86 180 top
S1  16.27,16.5 0 top
S2  41.27,16.5 0 top
SCK  49.53,33.56 90 top
SCL  3.81,33.53 270 top
SD_CS  54.61,33.56 90 top
SDA  6.35,33.53 270 top
SOLAR1+  25.4,63.5 0 top
SOLAR1-  32.16,63.5 0 top
SOLAR2+  20.32,63.5 0 top
SOLAR2-  37.24,63.5 0 top
SW1  24.13,3.17 180 top
SWCLK  52.07,18.7 90 top
SWDIO  54.61,18.7 90 top
U1  30.54,20.22 0 top
U2  17.78,24.16 270 top
U3  39.05,43.02 90 top
U4  12.03,33.69 180 top
U5  30.48,30.26 90 top
U6  9.46,52.83 270 top
U7  35.46,9.75 0 top
VBUS  52.07,16.16 90 top
X1  37.66,27.72 270 top

### Tracks (layer width: path | path; a pad name or v marks a point on that pad's centre or on a via)
3V3SW  (via drill 0.25 pad 0.81)
  Top 0.305: U6.7_VCC_IO U6.8_VCC
  Top 0.406: U4.1 12.03,31.75 12.03,35.56 U4.4 14.54,35.56 14.54,36.16 | C9.1 14.54,38.13 14.54,36.16 | C3.1 14.54,36.16 | v15.14,47.56 15.14,49.05 14.8,49.4 13.3,49.4 12.71,48.81 U6.8_VCC | v14.57,44.9 14.57,41.07 Q1.3
  Top 0.813: 3V3SW.1 8.41,38.13 C9.1 | 14.24,38.18 C9.1 | Q1.3 14.29,40.78 C9.1
  Bottom 0.406: v14.57,44.9 15.14,45.47 v15.14,47.56
!RESET  (via drill 0.2 pad 0.46, 0.2 pad 0.61, 0.25 pad 0.61)
  Top 0.203: U5.40 29.23,25.96 v27.69,24.42
  Top 0.305: U1.1 28.56,20.23 v27.69,20.23
  Top 0.406: SW1.2 SW1.1 26.96,3.98 27.88,4.89 27.88,5.27 29.08,6.48 v29.88,6.48 | 27.65,20.19 v27.69,20.23 27.69,16.16 28.26,15.59 29.05,15.59 30.09,14.56 30.58,14.07 30.58,13.84 v31.11,13.3
  Bottom 0.305: v27.69,20.23 v27.69,24.42
  Bottom 0.406: v31.11,13.3 30.73,12.92 30.73,7.3 29.91,6.48 v29.88,6.48
+3V3  (via drill 0.2 pad 0.41, 0.2 pad 0.46, 0.2 pad 0.61, 0.25 pad 0.41, 0.25 pad 0.61, 0.25 pad 0.81)
  Top 0.127: U5.6 35.06,30.01 | U5.36 26.96,27.46 | U5.44 31.24,26.77 | 24.45,27.46 24.57,27.59
  Top 0.203: 35.56,30.51 36.39,31.34 36.39,33.12 37.15,33.88 C5.1 | U5.6 34.87,30.01 | v35.56,30.77 35.56,30.51 | 35.56,30.51 35.06,30.01 | U5.17 31.23,34.63 v31.43,34.77 | 31.24,26.77 v31.24,25.94 | 24.57,27.59 v26.23,27.59 26.31,27.51 U5.36
  Top 0.305: R5.1 R8.1 14.92,29.84 v14.92,30.32 | v28.09,49.12 18.13,49.12 15.59,46.58 10.95,46.58 10.51,47.02 U6.6_V_BCKP
  Top 0.406: 24.45,27.46 23.81,26.83 C7.1 21.59,25.01 C8.1 U2.5 24.07,25.11 24.86,24.32 24.86,23.11 25.83,22.15 | v38.32,37.88 41.85,37.88 42.86,38.89 R4.2 48.26,39.97 52.07,36.16 3V3.1 | 38.26,37.88 C5.1 | 25.83,22.15 26.71,21.27 U1.3 | 25.83,22.15 24.35,20.67 24.35,12.93 C19.1 24.1,12.05 LED1.1
  Top 0.813: C8.1 v21.59,30.32 21.59,34.77 v22.73,35.91 | Q1.2 17.08,42 v18.03,42.96 18.03,44.42 C10.1
  Bottom 0.127: 31.23,32.48 28.26,32.48 28.26,27.91 31.24,27.91 32.7,27.91 32.7,30 32.7,32.48 31.24,32.48 31.23,32.48 | 31.23,32.48 U5.17
  Bottom 0.305: 32.7,30 35.05,30 35.56,30.51 v35.56,30.77 | v31.24,25.94 31.24,27.91 | 28.26,27.91 27.94,27.59 v26.23,27.59 | v31.43,34.77 31.24,34.58 31.24,32.48 | v14.92,30.32 v21.59,30.32
  Bottom 0.813: v22.73,35.91 22.73,41.31 21.14,42.89 | v18.03,42.96 21.08,42.96 21.14,42.89 | 21.14,42.89 21.18,42.93 21.18,46.8 23.5,49.12 v28.09,49.12 32.29,49.12 35.18,46.23 35.18,38.99 36.23,37.94 38.26,37.94 v38.32,37.88
  pour Bottom: 28.26,32.48 32.7,32.48 32.7,27.91 28.26,27.91
A0  (via drill 0.2 pad 0.46)
  Top 0.125: 35.8,11.82 U7.6 | 36.17,13.57 R7.2
  Top 0.203: U5.3 35.75,28.51 v35.97,28.73
  Top 0.305: 36.45,13.72 R7.2 | 35.8,11.82 35.8,13.19 36.17,13.57 | 44.32,12.82 44.33,12.82
  Top 0.406: 36.45,13.72 37.34,12.82 44.33,12.82 44.83,13.33 44.83,18.26 44.13,18.95 v44.13,20.19
  Bottom 0.305: v35.97,28.73 35.97,22.8 37.94,20.83 43.53,20.83 v44.13,20.19
A1  (via drill 0.2 pad 0.46)
  Top 0.127: R4.1
  Top 0.203: U3.5 40.04,40.89 R4.1 | U5.7 34.54,30.51 36.01,31.97 v36.01,34.64 | v40.96,38.58 R4.1
  Bottom 0.203: v36.01,34.64 39.37,34.64 40.96,36.23 v40.96,38.58
A3  (via drill 0.2 pad 0.46, 0.2 pad 0.61)
  Top 0.127: 33.98,31.53 U5.9
  Top 0.203: J1.19 23.98,44.44 v23.62,44.8 | v31.3,45.75 33.08,45.75 v33.97,44.86 | 33.98,31.53 34.86,31.53 35.43,32.1 v35.43,34.07
  Bottom 0.203: v23.62,44.8 23.62,45.37 24,45.75 v31.3,45.75 | v33.97,44.86 33.97,35.53 v35.43,34.07
AREF
  Top 0.203: U5.4 35.43,29.01 C14.1
D0  (via drill 0.2 pad 0.46, 0.2 pad 0.61)
  Top 0.203: v32.19,34.77 31.73,34.3 U5.16
  Top 0.305: v24,46.58 17.37,46.58 16.51,45.72 7.14,45.72 6.11,46.75 U6.2_TXD
  Bottom 0.203: v32.19,34.77 32.19,46.2 31.81,46.58 v24,46.58
D1  (via drill 0.2 pad 0.46, 0.2 pad 0.61)
  Top 0.127: 32.23,34.1 U5.15
  Top 0.203: v33.15,34.77 32.77,34.38 32.51,34.38 32.23,34.1
  Top 0.305: U6.3_RXD 7.21,47.07 8.13,46.15 16.02,46.15 17.53,47.66 v25.97,47.66
  Bottom 0.203: v33.15,34.77 33.15,46.39 31.88,47.66 v25.97,47.66
D5  (via drill 0.2 pad 0.46)
  Top 0.127: 27.75,33.75 U5.24
  Top 0.203: U3.4 39.56,41.31 39.69,41.18 39.69,40.04 39.94,39.78 v39.94,38.58 | 27.75,33.75 27.75,35.66 28.77,36.67 v34.67,36.67
  Bottom 0.203: v39.94,38.58 39.94,36.92 39.69,36.67 v34.67,36.67
D6  (via drill 0.2 pad 0.46, 0.2 pad 0.61)
  Top 0.127: U5.29
  Top 0.203: J1.5 27.27,43.75 v25.46,41.94 | v25.46,31.02 U5.29
  Bottom 0.203: v25.46,41.94 v25.46,31.02
D9  (via drill 0.2 pad 0.46, 0.2 pad 0.61)
  Top 0.203: U5.12 34.72,33.01 v34.92,32.8
  Top 0.305: R3.2 36.73,24.95 v36.73,25.15
  Top 0.406: R3.2 R6.1
  Bottom 0.305: v36.73,25.15 36.73,30.99 v34.92,32.8
D10  (via drill 0.2 pad 0.46)
  Top 0.127: 25.84,35.59 v25.97,35.72
  Top 0.203: U5.27 26.19,32.01 25.97,32.23 25.46,32.23 25.08,32.61 25.08,34.83 v25.97,35.72 | J1.6 27.27,38.67 v27.43,38.51
  Bottom 0.203: v25.97,35.72 26.67,35.72 27.43,36.48 v27.43,38.51
D11  (via drill 0.25 pad 0.61)
  Top 0.127: U5.25 26.78,33.01
  Top 0.203: 26.78,33.01 26.48,33.31 26.48,36.54 25.84,37.18 v21.27,37.18
  Top 0.406: v21.27,39.97 R1.2 19.81,40.1 Q1.1
  Bottom 0.203: v21.27,37.18 v21.27,39.97
D12  (via drill 0.2 pad 0.46, 0.2 pad 0.61)
  Top 0.127: 26.98,31.53 U5.28
  Top 0.203: v24.19,41.94 25.72,43.47 26.42,43.47 26.87,43.92 J1.7 | v24.19,31.78 25.72,31.78 25.97,31.53 26.98,31.53
  Bottom 0.203: v24.19,41.94 v24.19,31.78
D13  (via drill 0.2 pad 0.46, 0.2 pad 0.61)
  Top 0.203: v26.04,32.73 26.26,32.51 U5.26
  Top 0.305: v25.72,24.42 25.72,26.32 v25.02,27.02
  Top 0.406: v25.72,19.59 25.72,16.19 27.63,14.28 27.63,13.21 | 27.63,13.21 LED1.4 | R10.1 27.64,13.2 27.63,13.21
  Bottom 0.203: v26.04,32.73 26.04,30.19 24.77,28.92 24.77,27.27 v25.02,27.02
  Bottom 0.305: v25.72,19.59 v25.72,24.42
D+  (via drill 0.2 pad 0.46, 0.2 pad 0.61)
  Top 0.203: U5.34 26.06,28.51 v25.97,28.42
  Top 0.305: v27.05,25.94 v27.05,24.04 | v28.54,18.19 32.83,13.88 32.83,12.45 33.24,12.04 33.24,6.35 32.83,5.94 CON1.D+
  Bottom 0.152: 26.42,26.89 27.05,26.26
  Bottom 0.203: v25.97,28.42 25.72,28.16 25.72,27.4 26.23,26.89 26.42,26.89 | 27.05,26.26 v27.05,25.94
  Bottom 0.305: v28.54,18.19 27.05,19.59 v27.05,24.04
D-  (via drill 0.2 pad 0.46, 0.2 pad 0.61)
  Top 0.203: U5.33 25.61,29.01 v25.4,28.8
  Top 0.305: v26.42,26.26 v26.42,24.42 | v28.64,16.67 32.18,13.16 32.18,12.43 32.81,11.8 32.81,6.67 32.18,6.04 CON1.D-
  Bottom 0.127: v25.4,28.8 25.4,27.27 v26.42,26.26
  Bottom 0.305: v26.42,24.42 26.42,18.89 v28.64,16.67
GND  (via drill 0.2 pad 0.46, 0.25 pad 0.61, 0.25 pad 0.81)
  Top 0.127: U5.THERMAL 28.23,28.01 | U5.THERMAL 30.23,30.01 | U5.THERMAL 31.23,29.51 | U5.THERMAL 30.73,30.51 | J1.4 27.69,39.77 | U5.18 | R1.1 20.51,38.07 19.88,37.88 | 16.19,38.07 C9.2 | U5.42 | C4.2 41.78,28.92 | J1.15 | J1.18 24.89,39.77 | J1.8 | 37.15,43.02 37.15,42.96 | 25.15,27.94 25.91,27.94 26.35,28.07 26.95,28.07 U5.35
  Top 0.203: 28.23,28.01 U5.35 | 30.23,30.01 U5.42 | 31.23,29.51 U5.5 35.26,29.51 36.83,31.08 36.83,32.35 37.27,32.8 | 30.73,30.51 U5.18 | 27.67,41.56 J1.4 27.67,42.1 v27.05,42.1 | 27.67,41.56 J1.3 27.69,44.44 | C1.2 29.63,24.58 30.23,25.18 U5.42 | J1.15 25.27,45.75 | 25.27,45.75 22.48,45.75 | 27.69,44.44 27.69,45.75 25.59,45.75 | 25.59,45.75 25.27,45.75 | 24.89,37.88 24.89,39.77 24.89,40.42 25.23,40.76 26.87,40.76 | U3.11 U3.8 39.05,45.24 | U3.11 40.89,43.02 | U3.11 37.15,43.02 | J1.8 26.87,40.76 | 26.87,40.76 27.67,41.56 | U5.18 v30.73,34.77 | J1.8 26.86,37.88 26.86,37.81 | 25.65,37.88 25.65,39.75 J1.14 25.65,39.78 25.65,40.73 | J1.13 25.67,45.67 25.59,45.75 | 25.15,27.94 24.57,27.94 24.26,28.26 | 27.69,44.44 27.69,43.37 27.53,43.37 27.53,40.64 27.69,40.64 27.69,39.18 28.13,38.73 28.13,37.94 28.16,37.91
  Top 0.305: 39.71,32.8 C14.2 | 41.78,28.92 41.78,32.58 | 39.71,32.8 41.78,32.8 41.78,32.58 | 37.27,32.8 39.71,32.8 | 34.16,6.03 34.16,4.56 CON1.GND 34.16,4.53 34.16,2.1 33.79,2.1 CON1.BASE@2 | CON1.SPRT@3 30.09,4.75 CON1.SPRT@1 30.16,1.68 30.16,0.64 | CON1.SPRT@4 35.56,4.75 CON1.SPRT@2 35.24,1.68 35.24,0.64 | 24.26,28.26 23.02,29.5 23.02,33.66 23.65,34.29 23.65,36.2 23.18,36.67 22.07,36.67 21.78,36.39 19.94,36.39 20,36.45 20,37.94 | 29.54,23.82 31.48,21.88 U1.2 | 41.78,32.58 v41.02,31.81
  Top 0.406: 56.77,53.72 56.77,58.99 56.77,64.8 49.23,64.8 IRIDIUM.G@1 48.35,60.26 47.31,59.21 | 56.77,53.72 56.77,46.99 | 56.77,46.99 56.77,41.18 | 42.35,0.63 42.86,0.64 56.71,0.64 56.77,0.57 56.77,16.16 | 42.35,0.63 39.43,0.6 38.61,0.61 | 0.73,48.83 0.73,48.26 | 0.73,48.26 0.73,47.85 | 0.73,47.85 0.72,45.94 0.73,36.8 | 0.73,36.8 0.73,28.77 17.75,28.73 | 19.05,0.64 22.13,0.64 | 22.13,0.64 30.16,0.64 31.75,0.64 | 31.75,0.64 35.24,0.64 38.61,0.61 | U2.2 17.78,24.16 | 17.78,24.16 17.78,21.62 | 17.78,21.62 16.27,21.62 | 16.27,21.62 16.29,21.24 | 16.27,21.62 S1.P1 17.3,15.47 17.3,12.7 | C7.2 21.59,23.31 C8.2 21.59,21.62 | 21.59,21.62 17.78,21.62 | 19.88,37.88 24.89,37.88 25.65,37.88 26.86,37.88 v30.42,37.88 | 16.19,38.07 R1.1 19.94,36.39 | C9.2 16.26,38.13 | C2.2 C4.2 41.87,28.86 56.77,28.83 | 22.48,45.75 22.48,44.48 C10.2 | C5.2 v30.42,37.88 | C5.2 v30.42,37.88 | 40.89,43.02 v41.47,43.02 42.48,43.02 44.35,41.15 56.74,41.15 56.77,41.18 | 37.15,42.96 v36.39,42.96 35.24,42.96 C5.2 | 29.54,23.82 C1.2 28.73,23.01 v28.73,22.51 | SW1.4 SW1.3 22.08,0.69 22.13,0.64 | 17.78,24.16 17.78,26.04 | 19.94,34.31 19.94,36.39 | 17.8,34.31 19.94,34.31 | R6.2 | 41.59,23.53 41.81,23.74 41.84,23.71 R6.2 | 31.43,19.72 31.72,19.43 39.37,19.43 40.26,20.32 41.91,20.32 | 17.75,28.73 17.75,25.94 | v22.83,21.3 21.91,21.3 21.59,21.62 | v18.76,36.32 19.88,36.32 19.94,36.39 | 54.96,28.86 56.77,28.83 | 56.77,16.16 56.77,28.83 | GND.1 3.08,36.8 0.73,36.8 | 0.73,48.26 0.73,54.61 | 0.73,54.61 0.73,65.02 0.79,65.09 2,65.09 | 2,65.09 C18.2 | 19.05,0.64 17.81,0.64 17.3,1.14 17.3,8.89 | 17.3,8.89 17.3,12.7 | 19.07,0.65 19.05,0.64 | 38.61,0.61 38.61,6.92 37.83,7.7 U7.4 | CON1.BASE@1 31.75,1.33 31.75,0.64
  Top 0.406: BAT3.GND@1 BAT3.GND@2 43.15,8.73 42.32,7.9 42.32,0.67 42.35,0.63 | C2.2 41.85,26.41 | 41.91,20.32 v41.91,21.59 41.91,23.58 R6.2 | 41.91,20.32 41.91,19.49 41.85,19.43 41.85,17.08 S2.P1 34.82,16.5 33.43,15.11 33.43,12.64 33.72,12.35 33.72,6.48 34.16,6.03 | 47.31,59.21 CON4.2 46.27,57.16 45.85,56.74 44.32,56.74 43.52,57.54 | 43.52,57.54 CON4.1 42.45,59.21 | 42.45,59.21 41.36,60.3 IRIDIUM.G@4 37.66,63.92 SOLAR2-.1 SOLAR1-.1 30.44,65.22 17.48,65.22 GNSS.G@3 | C17.2 41.18,55.05 43.52,57.39 43.52,57.54 | 17.3,8.89 25.96,8.89 LED1.3 28.37,7.97 LED2.C | C13.2 17.8,34.31 | U4.3 16.2,34.31 C3.2 17.75,34.26 17.8,34.31 | U6.1_GND 0.76,47.88 0.73,47.85 | 2,65.09 8.04,65.09 GNSS.G@2 | 0.73,54.61 v8.89,54.61 11.59,54.61 | v15.24,54.61 13.75,54.61 | 13.75,54.61 11.59,54.61 | U6.12_GND 11.61,54.63 11.59,54.61 | U6.10_GND 13.76,54.62 13.75,54.61 | v40.64,58.42 41.66,58.42 42.45,59.21 | v49.53,58.42 48.1,58.42 47.31,59.21 | 56.77,28.83 56.77,36.07 | 56.77,36.07 56.77,41.18 | R6.2 41.84,26.42 C2.2 | GND3.1 56.77,16.16 | GND2.1 56.74,36.1 56.77,36.07 | 17.75,28.73 v19.94,28.73 19.94,34.31 | C19.2 17.34,12.67 17.3,12.7 | 16.27,21.62 8.22,21.62 7.27,22.57 C6.2 | 56.77,46.99 54.48,46.99 R11.1 54.35,46.1 53.82,45.56 48.04,45.56 47.37,46.23 R2.1 | JP1.1 56.77,53.72
  Top 0.61: C12.- 43.66,54.55 44.7,55.59 46.16,55.59 47.62,57.05 50.64,57.05 52.58,58.99 56.77,58.99
  Top 0.813: 39.05,45.24 39.05,46.7 | 39.05,46.7 C16.2 | C12.- 39.53,46.7 39.05,46.7
  Bottom 0.406: v30.73,34.77 30.42,35.08 v30.42,37.88 | GNSS.G@2 GNSS.G@3 17.95,63.92 19.23,65.21 30.51,65.21 31.96,63.7 | 31.96,63.7 SOLAR1-.1 | IRIDIUM.G@1 IRIDIUM.G@4 37.66,63.92 SOLAR2-.1 SOLAR1-.1 31.96,63.7
  pour Bottom (isolate 0.406, rank 2, hatched): 0,0 0,66.04 57.56,66.04 57.56,0
  pour Top (isolate 0.406, rank 2, hatched): 0,0 0,66.04 57.56,66.04 57.56,0
  pour Top (isolate 0.102): 0,66.04 19.05,66.04 19.05,45.72 0,45.72
  pour Top (isolate 0.102): 39.37,66.04 50.8,66.04 50.8,55.88 39.37,55.88
  pour Bottom (isolate 0.102): 6.35,66.04 19.05,66.04 19.05,53.34 6.35,53.34
  pour Bottom (isolate 0.102): 39.37,66.04 50.8,66.04 50.8,55.88 39.37,55.88
GPS_ANT
  Top 0.125: 12.75,60.12 L1.2 | 12.75,63.88 GNSS.1
  Top 0.406: 12.73,57.4 U6.11_RF_IN
  Top 0.813: L1.2 12.73,57.4 | 12.75,63.88 12.75,60.12
LTC3225_VOUT
  Top 0.127: 28.07,42.13 J1.2 28.19,39.77 28.19,42.01 | 28.07,42.13 J1.1 28.26,44.44 28.26,42.45 | 28.77,42.13 28.07,42.13 | 28.19,42.01 28.19,42.34 | 28.19,42.34 28.19,44.42 28.07,44.42 | 28.26,41.81 28.26,39.78 28.13,39.78 | 28.26,42.25 28.57,42.25 28.57,42.26 | 28.26,42.25 28.26,42.45 | 28.26,42.45 28.77,42.45 | 28.19,42.34 28.57,42.34 28.57,42.32 | 28.26,42.25 28.26,41.81 | 28.26,41.81 28.83,41.81 | 28.38,42.01 28.64,42.01 | 28.19,42.01 28.38,42.01 | 28.38,42.01 28.38,41.88 | 37.02,43.97 37.03,43.96
  Top 0.203: 37.03,43.96 U3.10
  Top 0.813: C11.+ 29.97,50.83 29.97,43.96 | 29.97,43.96 29.97,42.13 28.77,42.13 | 35.92,43.96 C16.1 | 35.92,43.96 29.97,43.96 | 35.92,43.96 35.93,43.97 37.02,43.97
MISO  (via drill 0.2 pad 0.46)
  Top 0.152: v38.35,36.16 42.29,36.16
  Top 0.203: U5.21 29.23,35.74 29.65,36.16 v36.01,36.16
  Top 0.305: MISO.1 49.47,36.16 42.29,36.16
  Bottom 0.152: v36.01,36.16 v38.35,36.16
MOSI  (via drill 0.2 pad 0.46)
  Top 0.127: U5.19
  Top 0.152: 30.35,35.21 v35.43,35.21
  Top 0.203: U5.19 30.23,35.08 30.35,35.21 | v38.35,35.21 43.31,35.21
  Top 0.305: 43.31,35.21 45.47,35.21 48.74,31.94 50.45,31.94 MOSI.1
  Bottom 0.203: v35.43,35.21 v38.35,35.21
N$1
  Top 0.406: L1.1 R9.1 8.95,60.77 8.48,61.25 5.21,61.25 C18.1
N$2
  Top 0.125: 44.88,60.75 CON4.3 | 44.88,63.88 IRIDIUM.1
  Top 0.813: 44.88,63.88 44.88,60.75
N$3
  Top 0.406: R10.2 29.56,10.1 LED2.A
N$4
  Top 0.813: SOLAR1+.1 25.4,60.17 D3.A
N$5
  Top 0.203: U5.1 35.84,27.51 X1.P$1
  Top 0.406: X1.P$1 36.96,26.52 36.96,26.45 C2.1
N$6  (via drill 0.2 pad 0.46)
  Top 0.203: U3.3 39.05,41.18 39.31,40.93 v39.31,38.58
  Top 0.813: C12.+ C11.-
  Bottom 0.406: v39.31,38.58 39.31,49.31 40.16,50.16 C12.+
N$7
  Top 0.203: U5.2 35.92,28.01 X1.P$2
  Top 0.406: X1.P$2 39.09,28.92 C4.1
N$8
  Bottom 0.813: BAT1.GND@1 BAT1.GND@2 BAT2.PWR@2 BAT2.PWR@1
N$9
  Top 0.127: 38.54,40.12 C15.2
  Top 0.203: U3.2 38.54,40.12
N$10
  Top 0.203: U3.1 38.06,41.29 C15.1
N$11
  Top 0.203: U3.7 39.56,44.58 40.01,45.02
  Top 0.406: 40.01,45.02 40.8,45.81 43.59,45.81 47.62,49.85 47.62,51.21 48.1,51.69 50.39,51.69 50.86,51.21 JP2.2
N$12
  Top 0.406: U4.2 15.08,33.06 C13.1
N$13  (via drill 0.25 pad 0.61)
  Top 0.305: U3.6 40.82,43.96 v41.37,44.51
  Top 0.406: v42.83,46.77 44.23,48.16 44.7,48.16 46.7,50.16 46.7,51.4 47.56,52.26 50.45,52.26 50.86,52.67 JP1.2
  Bottom 0.406: v41.37,44.51 41.37,45.31 v42.83,46.77
N$14
  Top 0.813: SOLAR2+.1 21.56,62.26 D2.A
N$15
  Bottom 0.813: BAT2.GND@2 BAT2.GND@1 BAT3.PWR@1 BAT3.PWR@2
N$16
  Top 0.406: CON1.VBUS 31.53,7.32 D4.A
N$17
  Top 0.406: JP2.3 49.34,46.93 R2.2
N$18
  Top 0.406: R11.2 52.39,46.93 JP2.1
SCK  (via drill 0.2 pad 0.46)
  Top 0.152: 30.16,35.72 v36.64,35.72
  Top 0.203: U5.20 29.73,35.29 30.16,35.72 | v38.99,35.72 42.86,35.72
  Top 0.305: 42.86,35.72 47.37,35.72 SCK.1
  Bottom 0.152: v36.64,35.72 v38.99,35.72
SCL  (via drill 0.2 pad 0.46, 0.25 pad 0.61)
  Top 0.203: U5.32 24.25,29.51 v24.07,29.69
  Top 0.305: R8.2 11.11,29.84 9.68,31.27 v9.68,31.81
  Top 0.406: U4.8 v9.68,31.81 5.53,31.81 SCL.1
  Bottom 0.203: v24.07,29.69 21.94,31.81
  Bottom 0.305: 21.94,31.81 v9.68,31.81
SD_CS  (via drill 0.2 pad 0.46)
  Top 0.203: U5.13 33.76,34.26 34.23,34.26 v34.92,33.56
  Top 0.305: v37.85,33.56 45.59,33.56 47.82,31.34 52.39,31.34 SD_CS.1
  Bottom 0.203: v34.92,33.56 v37.85,33.56
SDA  (via drill 0.2 pad 0.46, 0.25 pad 0.61)
  Top 0.203: U5.31 25.14,30.01 v24.77,30.39
  Top 0.305: R5.2 19.08,31.12 v19.08,33.06
  Top 0.406: U4.7 v9.65,33.06 7.25,33.05 6.86,33.05 SDA.1
  Bottom 0.203: v24.77,30.39 22.09,33.06
  Bottom 0.305: 22.09,33.06 v19.08,33.06 v9.65,33.06
SWCLK  (via drill 0.2 pad 0.46)
  Top 0.127: 31.75,26.76 U5.45
  Top 0.203: v31.75,25.3 31.75,26.76
  Bottom 0.305: v31.75,25.3 32.04,25.02 32.04,24.92 32.23,24.73 32.67,24.73 33.5,23.91 33.5,22.86 35.2,21.16 36.15,21.16 36.42,20.89 36.92,20.41 37.32,20.01 37.45,19.89 43,19.89 43.7,19.19 51.58,19.19 SWCLK.1
SWDIO  (via drill 0.2 pad 0.46)
  Top 0.127: 32.26,26.75 U5.46
  Top 0.203: v32.51,25.3 32.51,25.69 32.26,25.94 32.26,26.75
  Bottom 0.305: v32.51,25.3 33.12,25.3 34.29,24.13 34.29,22.86 35.56,21.59 36.32,21.59 37.62,20.32 43.18,20.32 43.88,19.62 50.1,19.62 50.8,20.32 52.99,20.32 SWDIO.1
VBAT  (via drill 0.25 pad 0.81)
  Top 0.813: v17.49,53.09 19.11,53.09 D1.A
  Bottom 0.813: v17.49,53.09 16.51,52.1 16.51,45.12 14.92,43.53 BAT1.PWR@2 BAT1.PWR@1
VBUS  (via drill 0.25 pad 0.61, 0.25 pad 0.81)
  Top 0.203: U3.9 38.54,44.35 v37.78,45.12
  Top 0.406: U2.1 15.81,25.11 | U2.3 14.57,23.21 14.51,23.27 | R3.1 36.33,22.79 37.24,21.88 | R7.1 35.12,14.31 v35.12,15.14 | D4.C v31.5,12.32 | v41.94,47.24 43.62,48.93 44.45,48.93 46.01,50.48 46.01,52.77 46.96,53.72 JP1.3
  Top 0.61: 15.81,25.11 15.81,25.4 | 15.81,25.4 v15.81,27.27 | 15.81,25.4 14.51,24.1 14.51,23.27 9.3,23.27 C6.1
  Top 0.813: v35.72,52.96 35.72,54.86 C17.1 | D1.C 25.24,53.12 v25.4,52.96 D3.C 25.4,55.3 D2.C | v35.53,20.16 37.24,21.88 37.91,22.55 v37.91,22.62
  Bottom 0.61: VBUS.1 46.65,16.16 43.29,12.81 39.91,12.81 37.58,15.14 v35.12,15.14
  Bottom 0.813: v15.81,27.27 18.8,27.27 20.54,25.53 20.54,16.29 21.68,15.14 31.75,15.14 | v25.4,52.96 v35.72,52.96 37.66,52.96 | 37.66,52.96 37.81,52.8 37.78,52.77 v37.78,45.12 | 37.66,52.96 41.27,52.96 41.94,52.29 v41.94,47.24 40.29,45.59 40.29,41.72 42.07,39.94 42.07,35.43 37.91,31.27 v37.91,22.62 | v35.53,20.16 35.12,19.75 v35.12,15.14 31.75,15.14 | 31.75,15.14 31.75,13.85 31.95,13.65 31.95,12.77 v31.5,12.32
VCC_RF
  Top 0.406: R9.2 7.94,59.09 7.94,58.93 8.1,58.77 8.98,58.77 9.41,58.34 U6.14_VCC_RF
VDDCORE1
  Top 0.127: U5.43
  Top 0.203: U5.43 30.73,25.11 31.33,24.52 C1.1

### Text on the board
Top: TOP
Bottom: BOTTOM
tPlace: + | - | 5.5V Max | 5.3V | 4.8V | U6 | 150mA | 60mA | Iridium 9603N / Beacon V4
bPlace: + | - | Please return to: | - | - | Iridium 9603N / Beacon V4